# Altium project ZYNQ-HS-DEV.PrjPcb (part 1 of 4)
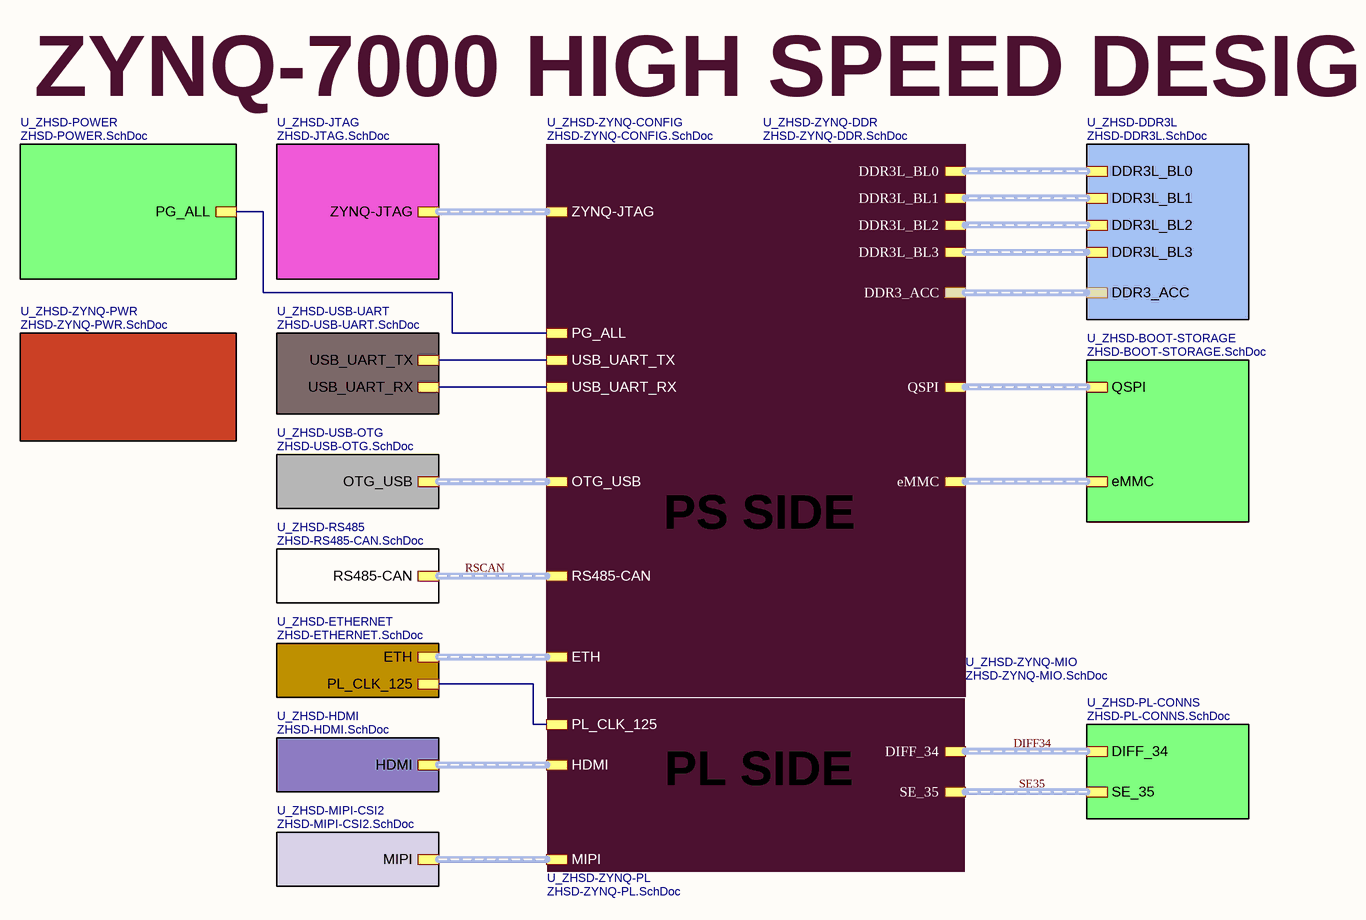
[diagram p0: ZHSD-Block.SchDoc]
17 sheets, 545 parts. Net scope: hierarchical (ports join the sheet entries above them; power ports are global).
Board file: ZYNQ-HS-DEV-PCB.PcbDoc
Sheets:
  ZHSD-Block.SchDoc
    U_ZHSD-ZYNQ-CONFIG = ZHSD-ZYNQ-CONFIG.SchDoc
    U_ZHSD-JTAG = ZHSD-JTAG.SchDoc
    U_ZHSD-ZYNQ-PWR = ZHSD-ZYNQ-PWR.SchDoc
    U_ZHSD-BOOT-STORAGE = ZHSD-BOOT-STORAGE.SchDoc
    U_ZHSD-ZYNQ-MIO = ZHSD-ZYNQ-MIO.SchDoc
    U_ZHSD-USB-OTG = ZHSD-USB-OTG.SchDoc
    U_ZHSD-ETHERNET = ZHSD-ETHERNET.SchDoc
    U_ZHSD-USB-UART = ZHSD-USB-UART.SchDoc
    U_ZHSD-RS485 = ZHSD-RS485-CAN.SchDoc
    U_ZHSD-ZYNQ-PL = ZHSD-ZYNQ-PL.SchDoc
    U_ZHSD-HDMI = ZHSD-HDMI.SchDoc
    U_ZHSD-MIPI-CSI2 = ZHSD-MIPI-CSI2.SchDoc
    U_ZHSD-ZYNQ-DDR = ZHSD-ZYNQ-DDR.SchDoc
    U_ZHSD-DDR3L = ZHSD-DDR3L.SchDoc
    U_ZHSD-POWER = ZHSD-POWER.SchDoc
    U_ZHSD-PL-CONNS = ZHSD-PL-CONNS.SchDoc

## Sheet ZHSD-Block.SchDoc
size 420 x 297 mm; DrawnBy: Muzaffer Nizam; DocumentNumber: 2; SheetNumber: 1; SheetTotal: 17; Size: A4

### Sub-sheets
U_ZHSD-BOOT-STORAGE = ZHSD-BOOT-STORAGE.SchDoc: QSPI (harness QSPI), eMMC (harness eMMC)
U_ZHSD-DDR3L = ZHSD-DDR3L.SchDoc: DDR3_ACC (harness DDR3_ACC), DDR3L_BL0 (harness DDR_H_BL0), DDR3L_BL1 (harness DDR_H_BL1), DDR3L_BL2 (harness DDR_H_BL2), DDR3L_BL3 (harness DDR_H_BL3)
U_ZHSD-ETHERNET = ZHSD-ETHERNET.SchDoc: ETH (harness ETH), PL_CLK_125
U_ZHSD-HDMI = ZHSD-HDMI.SchDoc: HDMI (harness HDMI)
U_ZHSD-JTAG = ZHSD-JTAG.SchDoc: ZYNQ-JTAG (harness JTAG)
U_ZHSD-MIPI-CSI2 = ZHSD-MIPI-CSI2.SchDoc: MIPI (harness MIPI)
U_ZHSD-PL-CONNS = ZHSD-PL-CONNS.SchDoc: DIFF_34 (harness PL34_DIFF), SE_35 (harness PL35_SE)
U_ZHSD-POWER = ZHSD-POWER.SchDoc: PG_ALL
U_ZHSD-RS485 = ZHSD-RS485-CAN.SchDoc: RS485-CAN (harness RS485-CAN)
U_ZHSD-USB-OTG = ZHSD-USB-OTG.SchDoc: OTG_USB (harness OTG)
U_ZHSD-USB-UART = ZHSD-USB-UART.SchDoc: USB_UART_TX, USB_UART_RX
U_ZHSD-ZYNQ-CONFIG = ZHSD-ZYNQ-CONFIG.SchDoc: ZYNQ-JTAG (harness JTAG)
U_ZHSD-ZYNQ-DDR = ZHSD-ZYNQ-DDR.SchDoc: DDR3L_BL0 (harness DDR_H_BL0), DDR3_ACC (harness DDR3_ACC), DDR3L_BL1 (harness DDR_H_BL1), DDR3L_BL2 (harness DDR_H_BL2), DDR3L_BL3 (harness DDR_H_BL3)
U_ZHSD-ZYNQ-MIO = ZHSD-ZYNQ-MIO.SchDoc: QSPI (harness QSPI), eMMC (harness eMMC), OTG_USB (harness OTG), ETH (harness ETH), USB_UART_TX, USB_UART_RX, RS485-CAN (harness RS485-CAN), PG_ALL
U_ZHSD-ZYNQ-PL = ZHSD-ZYNQ-PL.SchDoc: HDMI (harness HDMI), MIPI (harness MIPI), PL_CLK_125, DIFF_34 (harness PL34_DIFF), SE_35 (harness PL35_SE)
U_ZHSD-ZYNQ-PWR = ZHSD-ZYNQ-PWR.SchDoc: no entries

### Nets
3V3_PG: sheet U_ZHSD-ZYNQ-MIO/PG_ALL, sheet U_ZHSD-POWER/PG_ALL
PL_CLK_125: sheet U_ZHSD-ETHERNET/PL_CLK_125, sheet U_ZHSD-ZYNQ-PL/PL_CLK_125
USB_UART_RX: sheet U_ZHSD-ZYNQ-MIO/USB_UART_RX, sheet U_ZHSD-USB-UART/USB_UART_RX
USB_UART_TX: sheet U_ZHSD-ZYNQ-MIO/USB_UART_TX, sheet U_ZHSD-USB-UART/USB_UART_TX

### Buses and harness runs
harness DIFF34 = sheet U_ZHSD-PL-CONNS/DIFF_34 = sheet U_ZHSD-ZYNQ-PL/DIFF_34
harness RSCAN = sheet U_ZHSD-RS485/RS485-CAN = sheet U_ZHSD-ZYNQ-MIO/RS485-CAN
harness SE35 = sheet U_ZHSD-PL-CONNS/SE_35 = sheet U_ZHSD-ZYNQ-PL/SE_35
harness sheet U_ZHSD-BOOT-STORAGE/eMMC = sheet U_ZHSD-ZYNQ-MIO/eMMC
harness sheet U_ZHSD-BOOT-STORAGE/QSPI = sheet U_ZHSD-ZYNQ-MIO/QSPI
harness sheet U_ZHSD-DDR3L/DDR3_ACC = sheet U_ZHSD-ZYNQ-DDR/DDR3_ACC
harness sheet U_ZHSD-DDR3L/DDR3L_BL0 = sheet U_ZHSD-ZYNQ-DDR/DDR3L_BL0
harness sheet U_ZHSD-DDR3L/DDR3L_BL1 = sheet U_ZHSD-ZYNQ-DDR/DDR3L_BL1
harness sheet U_ZHSD-DDR3L/DDR3L_BL2 = sheet U_ZHSD-ZYNQ-DDR/DDR3L_BL2
harness sheet U_ZHSD-DDR3L/DDR3L_BL3 = sheet U_ZHSD-ZYNQ-DDR/DDR3L_BL3
harness sheet U_ZHSD-ETHERNET/ETH = sheet U_ZHSD-ZYNQ-MIO/ETH
harness sheet U_ZHSD-HDMI/HDMI = sheet U_ZHSD-ZYNQ-PL/HDMI
harness sheet U_ZHSD-JTAG/ZYNQ-JTAG = sheet U_ZHSD-ZYNQ-CONFIG/ZYNQ-JTAG
harness sheet U_ZHSD-MIPI-CSI2/MIPI = sheet U_ZHSD-ZYNQ-PL/MIPI
harness sheet U_ZHSD-USB-OTG/OTG_USB = sheet U_ZHSD-ZYNQ-MIO/OTG_USB

### Notes on the sheet
- ZYNQ-7000 HIGH SPEED DESIGN
- PS SIDE
- PL SIDE
- THIS DOCUMENT AND THE DATA DISCLOSED HEREIN OR
- HEREWITH IS THE PROPERTY OF ALTIUM LIMITED AND MAY
- DWG NO:
- REVISION
- REV:
- DESCRIPTION
- DATE
- APPROVED
- BE FREELY DISTRIBUTED IN WHOLE. NO RIGHTS ARE
- RESERVED OR EXPRESS OR IMPLIED WARANTEE GIVEN.
- ENG:
- APPROVALS
- PROJECT
- DSN:
- CHK:
- REFERENCE DOCUMENTS
- PROJECT REVISION:
- TITLE
- DOCUMENT REVISION:
- DESIGN ITEM:
- BOM:
- FAB DWG:
- PCB DWG:
- ASSY DWG:
- SCALE:
- A3
- SIZE
- CAGE CODE
- FILE NAME
- DWG NO.
- SHEET
- OF
- REV

## Sheet ZHSD-ZYNQ-CONFIG.SchDoc
size 420 x 297 mm; DocumentNumber: 4; SheetNumber: 4; SheetTotal: 17; Size: A4
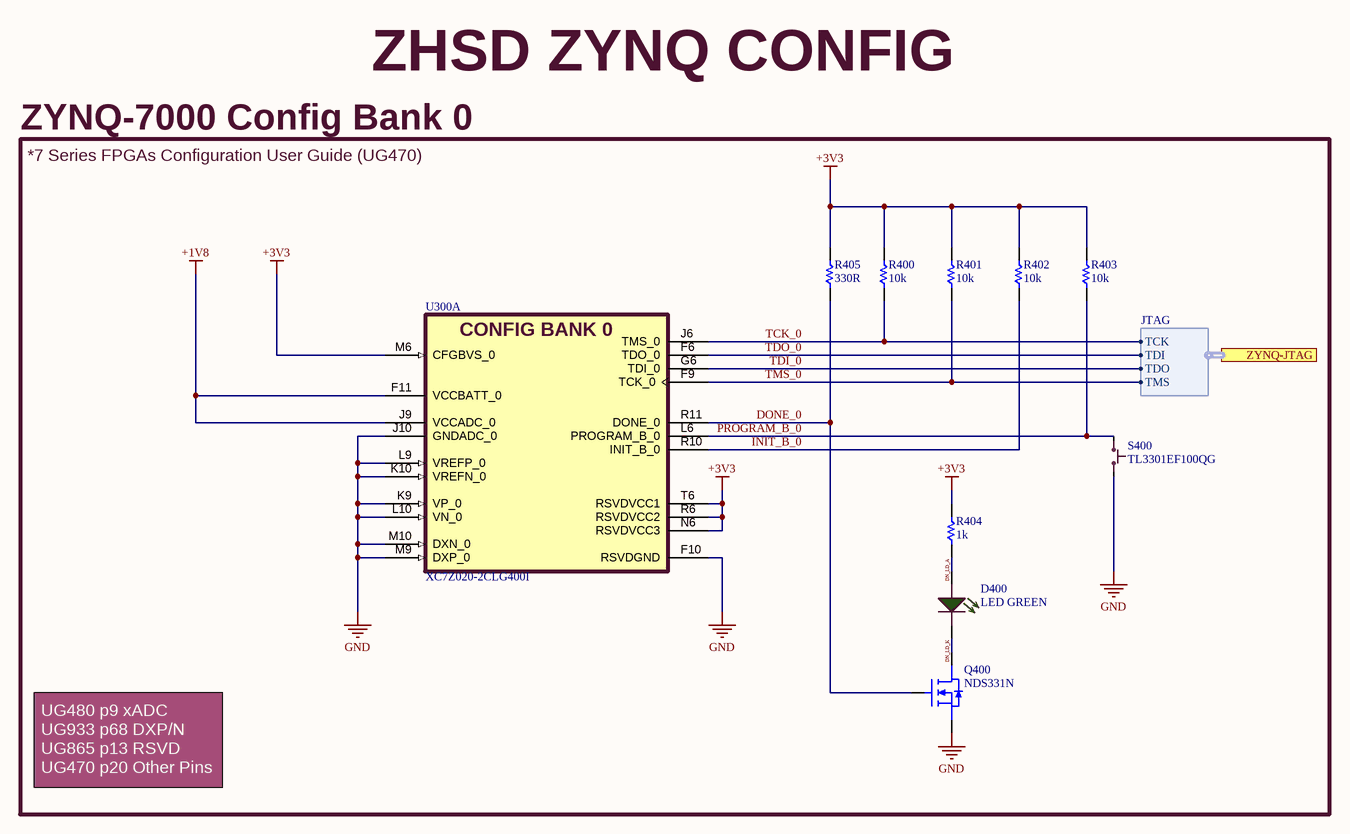
[diagram p1: ZHSD-ZYNQ-CONFIG.SchDoc]

### Parts
D400  LED GREEN  [0603_LED_1608N]
Q400  NDS331N  [SOT95P251X112-3N]
R400  10k  [0603RESC1608X05N]
R401  10k  [0603RESC1608X05N]
R402  10k  [0603RESC1608X05N]
R403  10k  [0603RESC1608X05N]
R404  1k  [0402RESC1005X04N]
R405  330R  [0603RESC1608X05N]
S400  TL3301EF100QG  [TL3301_Tact_SW]
U300  XC7Z020-2CLG400I  [BGA400C80P20X20_1700X1700X147]  (part A of 8)

### Ports
ZYNQ-JTAG (harness JTAG, see ZHSD-Block[174.76,200.78], ZHSD-JTAG[297.22,176.76])

### Harnesses
JTAG: TCK, TDI, TDO, TMS

### Nets
+1V8: U300.F11(VCCBATT_0) U300.J9(VCCADC_0)
+3V3: R400.2 R401.2 R402.2 R403.2 R404.2 R405.2 U300.M6(CFGBVS_0) U300.N6(RSVDVCC3) U300.R6(RSVDVCC2) U300.T6(RSVDVCC1)
GND: Q400.2(S) S400.1,2 U300.F10(RSVDGND) U300.J10(GNDADC_0) U300.K9(VP_0) U300.K10(VREFN_0) U300.L9(VREFP_0) U300.L10(VN_0) U300.M9(DXP_0) U300.M10(DXN_0)
DN_LD_A: D400.1(A) R404.1
DN_LD_K: D400.2(C) Q400.3(D)
DONE_0: Q400.1(G) R405.1 U300.R11(DONE_0)
INIT_B_0: R402.1 U300.R10(INIT_B_0)
PROGRAM_B_0: R403.1 S400.3,4 U300.L6(PROGRAM_B_0)
TCK_0: R400.1 U300.J6(TMS_0) ; port ZYNQ-JTAG.TCK
TDI_0: U300.G6(TDI_0) ; port ZYNQ-JTAG.TDO
TDO_0: U300.F6(TDO_0) ; port ZYNQ-JTAG.TDI
TMS_0: R401.1 U300.F9(TCK_0) ; port ZYNQ-JTAG.TMS

### Notes on the sheet
- ZHSD ZYNQ CONFIG
- ZYNQ-7000 Config Bank 0
- *7 Series FPGAs Configuration User Guide (UG470)
- UG480 p9 xADC
  UG933 p68 DXP/N
  UG865 p13 RSVD
  UG470 p20 Other Pins
- THIS DOCUMENT AND THE DATA DISCLOSED HEREIN OR
- HEREWITH IS THE PROPERTY OF ALTIUM LIMITED AND MAY
- DWG NO:
- REVISION
- REV:
- DESCRIPTION
- DATE
- APPROVED
- BE FREELY DISTRIBUTED IN WHOLE. NO RIGHTS ARE
- RESERVED OR EXPRESS OR IMPLIED WARANTEE GIVEN.
- ENG:
- APPROVALS
- PROJECT
- DSN:
- CHK:
- REFERENCE DOCUMENTS
- PROJECT REVISION:
- TITLE
- DOCUMENT REVISION:
- DESIGN ITEM:
- BOM:
- FAB DWG:
- PCB DWG:
- ASSY DWG:
- SCALE:
- A3
- SIZE
- CAGE CODE
- FILE NAME
- DWG NO.
- SHEET
- OF
- REV
- (in symbol XC7Z020-2CLG400I, part A) CONFIG BANK 0

### Library data of the parts
D400 = LTST-C191TGKT: LED GREEN CLEAR CHIP SMD; Manufacturer: Lite-On Inc.; ComponentLink1Description: Datasheet; ComponentLink1URL: https://optoelectronics.liteon.com/upload/download/DS22-2000-300/LTST-C191TGKT.PDF; MPN: LTST-C191TGKT; Package: 0603
Q400 = NDS331N: N-Channel 20 V 1.3A (Ta) 500mW (Ta) Surface Mount SOT-23-3; Manufacturer: onsemi; Drain to Source Voltage (Vdss): 20 V; Rds On (Max) @ Id, Vgs: 160mOhm @ 1.5A, 4.5V; Vgs (Max): ±8V; ComponentLink1Description: Datasheet; ComponentLink1URL: https://www.onsemi.com/pdf/datasheet/nds331n-d.pdf; MPN: NDS331N; Package: SOT-23-3
R400-R403 = RC0603FR-0710KL: RES 10K OHM 1% 1/10W 0603(1608); Manufacturer: YAGEO; Value: 10 kOhms; Voltage: 75V; ComponentLink1Description: Datasheet; ComponentLink1URL: https://yageogroup.com/content/datasheet/asset/file/PYU-RC_GROUP_51_ROHS_L; MPN: RC0603FR-0710KL; Tolerance: ±1%; Package: 0603
R404 = RC0402JR-071KL: RES 1K OHM 5% 1/16W 0402 (1005); Manufacturer: YAGEO; Value: 1 kOhms; Voltage: 50V; ComponentLink1Description: Datasheet; ComponentLink1URL: https://yageogroup.com/content/datasheet/asset/file/PYU-RT_1-TO-0-01_ROHS_L; MPN: RC0402JR-071KL; Tolerance: ±5%; Package: 0402
R405 = RC0603FR-07330RL: RES 330 OHM 1% 1/10W 0603(1608); Manufacturer: YAGEO; Value: 330 Ohms; Voltage: 75V; ComponentLink1Description: Datasheet; ComponentLink1URL: https://yageogroup.com/content/datasheet/asset/file/PYU-RC_GROUP_51_ROHS_L; MPN: RC0603FR-07330RL; Tolerance: ±1%; Package: 0603
S400 = TL3301EF100QG: SWITCH TACTILE SPST-NO 0.05A 12V; pin to pad: 1,2>1+2 3,4>3+4; Manufacturer: E-Switch; ComponentLink1Description: Datasheet; ComponentLink1URL: https://configured-product-images.s3.amazonaws.com/Datasheets/TL3301.pdf; MPN: TL3301EF100QG
U300 = XC7Z020-2CLG400I: Dual ARM® Cortex®-A9 MPCore™ with CoreSight™ System On Chip (SOC) IC Zynq®-7000 Artix™-7 FPGA, 85K Logic Cells 766MHz 400-CSPBGA (17x17); Manufacturer: AMD/XILINX; MPN: XC7Z020-2CLG400I; ComponentLink1Description: Datasheet; ComponentLink1URL: https://docs.amd.com/v/u/en-US/ds190-Zynq-7000-Overview; ComponentLink2Description: DC and AC Switching Characteristics; ComponentLink2URL: https://docs.amd.com/v/u/en-US/ds187-XC7Z010-XC7Z020-Data-Sheet; ComponentLink3Description: PCB Design Guide; ComponentLink3URL: https://docs.amd.com/v/u/en-US/ug933-Zynq-7000-PCB; ComponentLink4Description: Packaging and Pinout; ComponentLink4URL: https://docs.amd.com/v/u/en-US/ug865-Zynq-7000-Pkg-Pinout; ComponentLink5Description: Zynq 7000 SoC Technical Reference Manual; ComponentLink5URL: https://docs.amd.com/r/en-US/ug585-zynq-7000-SoC-TRM

## Sheet ZHSD-JTAG.SchDoc
size 420 x 297 mm; DocumentNumber: 5; SheetNumber: 5; SheetTotal: 17; Size: A4
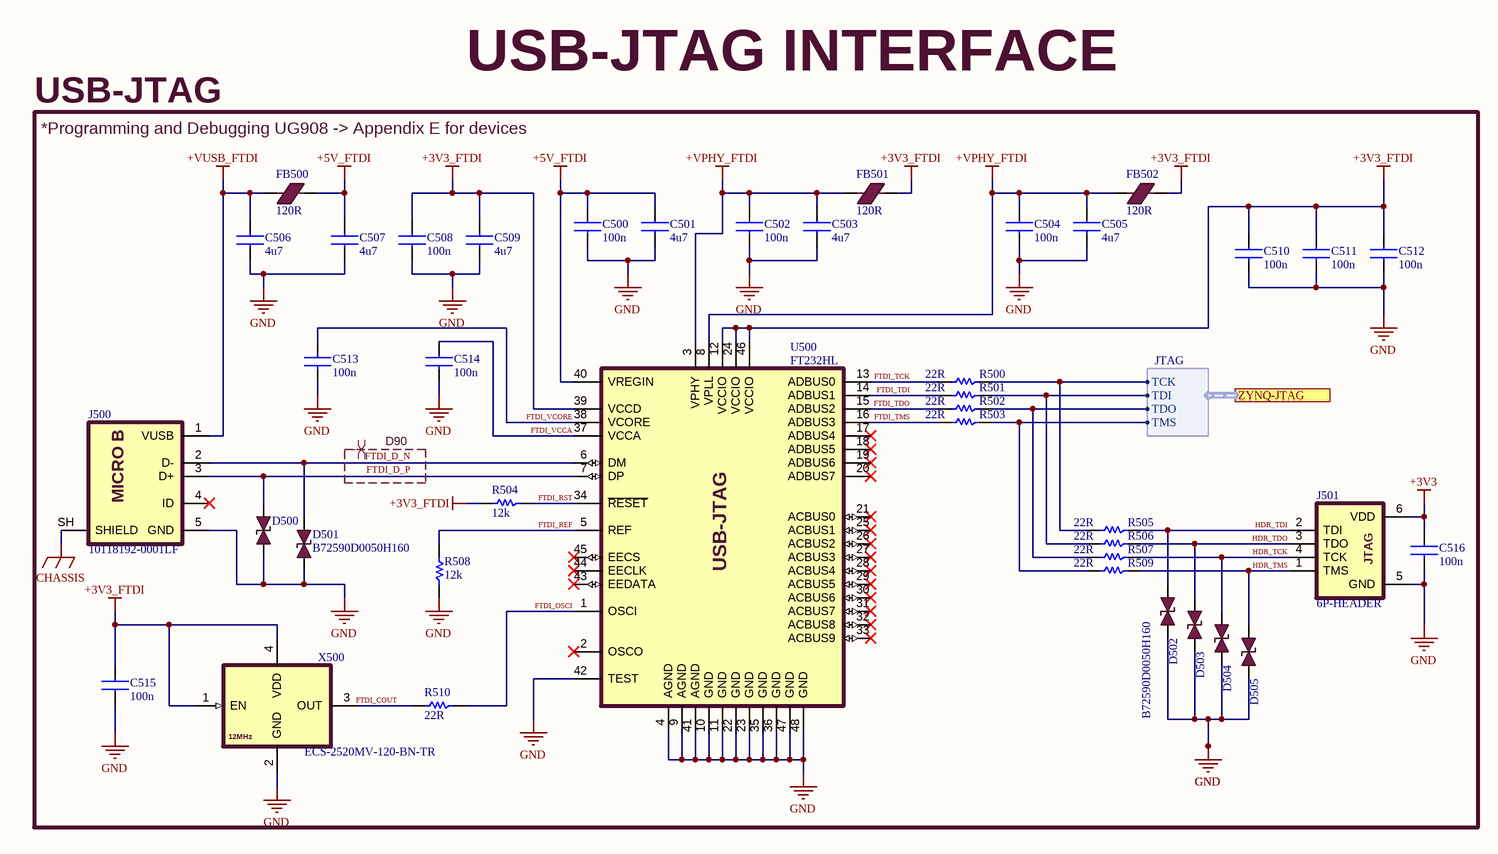
[diagram p2: ZHSD-JTAG.SchDoc]

### Parts
C500  100n  [0603CAPC1608X09N]
C501  4u7  [0603CAPC1608X09N]
C502  100n  [0603CAPC1608X09N]
C503  4u7  [0603CAPC1608X09N]
C504  100n  [0603CAPC1608X09N]
C505  4u7  [0603CAPC1608X09N]
C506  4u7  [0603CAPC1608X09N]
C507  4u7  [0603CAPC1608X09N]
C508  100n  [0603CAPC1608X09N]
C509  4u7  [0603CAPC1608X09N]
C510  100n  [0603CAPC1608X09N]
C511  100n  [0603CAPC1608X09N]
C512  100n  [0603CAPC1608X09N]
C513  100n  [0603CAPC1608X09N]
C514  100n  [0603CAPC1608X09N]
C515  100n  [0603CAPC1608X09N]
C516  100n  [0603CAPC1608X09N]
D500  B72590D0050H160  [0402DIOC1005X06N]  (value not drawn)
D501  B72590D0050H160  [0402DIOC1005X06N]
D502  B72590D0050H160  [0402DIOC1005X06N]  (value not drawn)
D503  B72590D0050H160  [0402DIOC1005X06N]  (value not drawn)
D504  B72590D0050H160  [0402DIOC1005X06N]  (value not drawn)
D505  B72590D0050H160  [0402DIOC1005X06N]
FB500  120R  [0603INDC1608X08N]
FB501  120R  [0603INDC1608X08N]
FB502  120R  [0603INDC1608X08N]
J500  10118192-0001LF  [USB2.0 MICRO B SMD]
J501  6P-HEADER  [CONN-6P-HEADER]
R500  22R  [0603RESC1608X05N]
R501  22R  [0603RESC1608X05N]
R502  22R  [0603RESC1608X05N]
R503  22R  [0603RESC1608X05N]
R504  12k  [0603RESC1608X05N]
R505  22R  [0603RESC1608X05N]
R506  22R  [0603RESC1608X05N]
R507  22R  [0603RESC1608X05N]
R508  12k  [0603RESC1608X05N]
R509  22R  [0603RESC1608X05N]
R510  22R  [0603RESC1608X05N]
U500  FT232HL  [LQFP50P900X900X160-48N]
X500  ECS-2520MV-120-BN-TR  [XTAL_2520]

### Ports
ZYNQ-JTAG (harness JTAG, see ZHSD-Block[154.44,200.78], ZHSD-ZYNQ-CONFIG[302.46,177.38])

### Harnesses
JTAG: TCK, TDI, TDO, TMS

### Nets
+3V3: C516.2 J501.6(VDD)
+3V3_FTDI: C508.2 C509.2 C510.2 C511.2 C512.2 C515.2 FB501.2 FB502.2 R504.1 U500.12(VCCIO) U500.24(VCCIO) U500.39(VCCD) U500.46(VCCIO) X500.1(EN) X500.4(VDD)
+5V_FTDI: C500.2 C501.2 C507.2 FB500.2 U500.40(VREGIN)
+VPHY_FTDI: C502.2 C503.2 C504.2 C505.2 FB501.1 FB502.1 U500.3(VPHY) U500.8(VPLL)
+VUSB_FTDI: C506.2 FB500.1 J500.1(VUSB)
CHASSIS: J500.SH(SHIELD)
GND: C500.1 C501.1 C502.1 C503.1 C504.1 C505.1 C506.1 C507.1 C508.1 C509.1 C510.1 C511.1 C512.1 C513.1 C514.1 C515.1 C516.1 D500.1 D501.1 D502.1 D503.1 D504.1 D505.1 J500.5(GND) J501.5(GND) R508.2 U500.4(AGND) U500.9(AGND) U500.10(GND) U500.11(GND) U500.22(GND) U500.23(GND) U500.35(GND) U500.36(GND) U500.41(AGND) U500.42(TEST) U500.47(GND) U500.48(GND) X500.2(GND)
FTDI_COUT: R510.1 X500.3(OUT)
FTDI_D_N: D501.2 J500.2(D-) U500.6(DM)
FTDI_D_P: D500.2 J500.3(D+) U500.7(DP)
FTDI_OSCI: R510.2 U500.1(OSCI)
FTDI_REF: R508.1 U500.5(REF)
FTDI_RST: R504.2 U500.34(~{RESET})
FTDI_TCK: R500.1 U500.13(ADBUS0)
FTDI_TDI: R501.1 U500.14(ADBUS1)
FTDI_TDO: R502.1 U500.15(ADBUS2)
FTDI_TMS: R503.1 U500.16(ADBUS3)
FTDI_VCCA: C514.2 U500.37(VCCA)
FTDI_VCORE: C513.2 U500.38(VCORE)
HDR_TCK: D504.2 J501.4(TCK) R507.2
HDR_TDI: D502.2 J501.2(TDI) R505.2
HDR_TDO: D503.2 J501.3(TDO) R506.2
HDR_TMS: D505.2 J501.1(TMS) R509.2
TCK_0: R500.2 R505.1 ; port ZYNQ-JTAG.TCK
TDI_0: R502.2 R507.1 ; port ZYNQ-JTAG.TDO
TDO_0: R501.2 R506.1 ; port ZYNQ-JTAG.TDI
TMS_0: R503.2 R509.1 ; port ZYNQ-JTAG.TMS

Not connected (* = marked no-connect by the designer): J500 4(ID)*; U500 2(OSCO)* 17(ADBUS4)* 18(ADBUS5)* 19(ADBUS6)* 20(ADBUS7)* 21(ACBUS0)* 25(ACBUS1)* 26(ACBUS2)* 27(ACBUS3)* 28(ACBUS4)* 29(ACBUS5)* 30(ACBUS6)* 31(ACBUS7)* 32(ACBUS8)* 33(ACBUS9)* 43(EEDATA)* 44(EECLK)* 45(EECS)*

### Layout directives
differential pair; differential pair class USB; rule Differential Pairs Routing [Pref Gap = 6.299mil    Min Gap  = 5mil    Max Gap  = 7.874milPref Width = 3.937mil    Min Width  = 3.937mil    Max Width  = 4.768mil]; Impedance: D90: FTDI_D_N, FTDI_D_P

### Notes on the sheet
- USB-JTAG INTERFACE
- USB-JTAG
- *Programming and Debugging UG908 -> Appendix E for devices
- THIS DOCUMENT AND THE DATA DISCLOSED HEREIN OR
- HEREWITH IS THE PROPERTY OF ALTIUM LIMITED AND MAY
- DWG NO:
- REVISION
- REV:
- DESCRIPTION
- DATE
- APPROVED
- BE FREELY DISTRIBUTED IN WHOLE. NO RIGHTS ARE
- RESERVED OR EXPRESS OR IMPLIED WARANTEE GIVEN.
- ENG:
- APPROVALS
- PROJECT
- DSN:
- CHK:
- REFERENCE DOCUMENTS
- PROJECT REVISION:
- TITLE
- DOCUMENT REVISION:
- DESIGN ITEM:
- BOM:
- FAB DWG:
- PCB DWG:
- ASSY DWG:
- SCALE:
- A3
- SIZE
- CAGE CODE
- FILE NAME
- DWG NO.
- SHEET
- OF
- REV
- (in symbol ECS-2520MV-120-BN-TR) 12MHz
- (in symbol FT232HL) USB-JTAG
- (in symbol JTAG-HEADER) JTAG
- (in symbol USB-MICRO-B) MICRO B

### Library data of the parts
C500 C502 C504 C508 C510-C516 = GRM155R71C104KA88J: CAP CER 0.1UF 16V X7R 0402 (1005) ±10%; Manufacturer: Murata Electronics; Value: 0.1 µF; ComponentLink1Description: Datasheet; ComponentLink1URL: https://search.murata.co.jp/Ceramy/image/img/A01X/G101/ENG/GRM155R71C104KA88-01.pdf; MPN: GRM155R71C104KA88J; Package: 0402; Tolerance: ±10%; Voltage: 16V
C501 C503 C505-C507 C509 = CL10A475KP8NNNC: CAP CER 4.7UF 10V X5R 0603 (1608) ±10%; Manufacturer: Samsung Electro-Mechanics; Value: 4.7 µF; ComponentLink1Description: Datasheet; ComponentLink1URL: https://mm.digikey.com/Volume0/opasdata/d220001/medias/docus/609/CL10A475KP8NNNC_Spec.pdf; MPN: CL10A475KP8NNNC; Package: 0603; Tolerance: ±10%; Voltage: 10V
D500-D505 = B72590D0050H160: Varistor 1 Circuit Surface Mount, MLCV 0402 (1005 Metric); Manufacturer: EPCOS - TDK Electronics; ComponentLink1Description: Datasheet; ComponentLink1URL: https://www.tdk-electronics.tdk.com/inf/75/ds/High_speed_series.pdf?ref_disty=digikey; MPN: B72590D0050H160; Package: 0402
FB500-FB502 = BLM18SG121TN1D: FERRITE BEAD 120 OHM 0603 (1608) 3A 25mOhm; Manufacturer: Murata Electronics; Impedance @ Frequency: 120 Ohms @ 100 MHz; ComponentLink1Description: Datasheet; ComponentLink1URL: https://pim.murata.com/asset/pim4/ferriteBeadInductortypefilter/ENFA0003_PDF_FERRITEBEADINDUCTORTYPEFILTER?lastModifiedDatetime=20250707190934; ComponentLink2Description: Website; ComponentLink2URL: https://pim.murata.com/en-global/pim/details/?partNum=BLM18SG121TN1%23; Current Rating (Max): 3A; DC Resistance (DCR) (Max): 25mOhm; MPN: BLM18SG121TN1D; Package: 0603
J500 = USB-MICRO-B: CONN RCPT USB2.0 MICRO B SMD R/A; Manufacturer: Amphenol ICC (FCI); ComponentLink1Description: Datasheet; ComponentLink1URL: https://cdn.amphenol-cs.com/media/wysiwyg/files/documentation/datasheet/inputoutput/io_usb_micro.pdf; MPN: 10118192-0001LF
J501 = JTAG-HEADER: JTAG CONN HEADER VERT 6POS 2.54MM
R500-R503 R505-R507 R509 R510 = RC0603FR-0722RL: RES 22 OHM 1% 1/10W 0603 (1608); Manufacturer: YAGEO; Value: 22 Ohms; Voltage: 75V; ComponentLink1Description: Datasheet; ComponentLink1URL: https://yageogroup.com/content/datasheet/asset/file/PYU-RC_GROUP_51_ROHS_L; MPN: RC0603FR-0722RL; Tolerance: ±1%; Package: 0603
R504 R508 = RC0603FR-0712KL: RES 12K OHM 1% 1/10W 0603 (1608); Manufacturer: YAGEO; Value: 12 kOhms; Voltage: 75V; ComponentLink1Description: Datasheet; ComponentLink1URL: https://yageogroup.com/content/datasheet/asset/file/PYU-RC_GROUP_51_ROHS_L; MPN: RC0603FR-0712KL; Tolerance: ±1%; Package: 0603
U500 = FT232HL: USB Bridge, USB to UART (JTAG),FIFO USB 2.0 UART, FIFO Interface 48-LQFP (7x7); Manufacturer: FTDI, Future Technology Devices International Ltd; MPN: FT232HL-REEL; ComponentLink1Description: Datasheet; ComponentLink1URL: https://ftdichip.com/wp-content/uploads/2024/09/DS_FT232H.pdf#page=51&zoom=100,72,126
X500 = ECS-2520MV-120-BN-TR: XTAL OSC XO 12.0000MHZ CMOS SMD; Manufacturer: ECS Inc.; ComponentLink1Description: Datasheet; ComponentLink1URL: https://ecsxtal.com/store/pdf/ECS-2520MV.pdf; MPN: ECS-2520MV-120-BN-TR

## Sheet ZHSD-ZYNQ-PWR.SchDoc
size 420 x 297 mm; DocumentNumber: 3; SheetNumber: 3; SheetTotal: 17; Size: A3
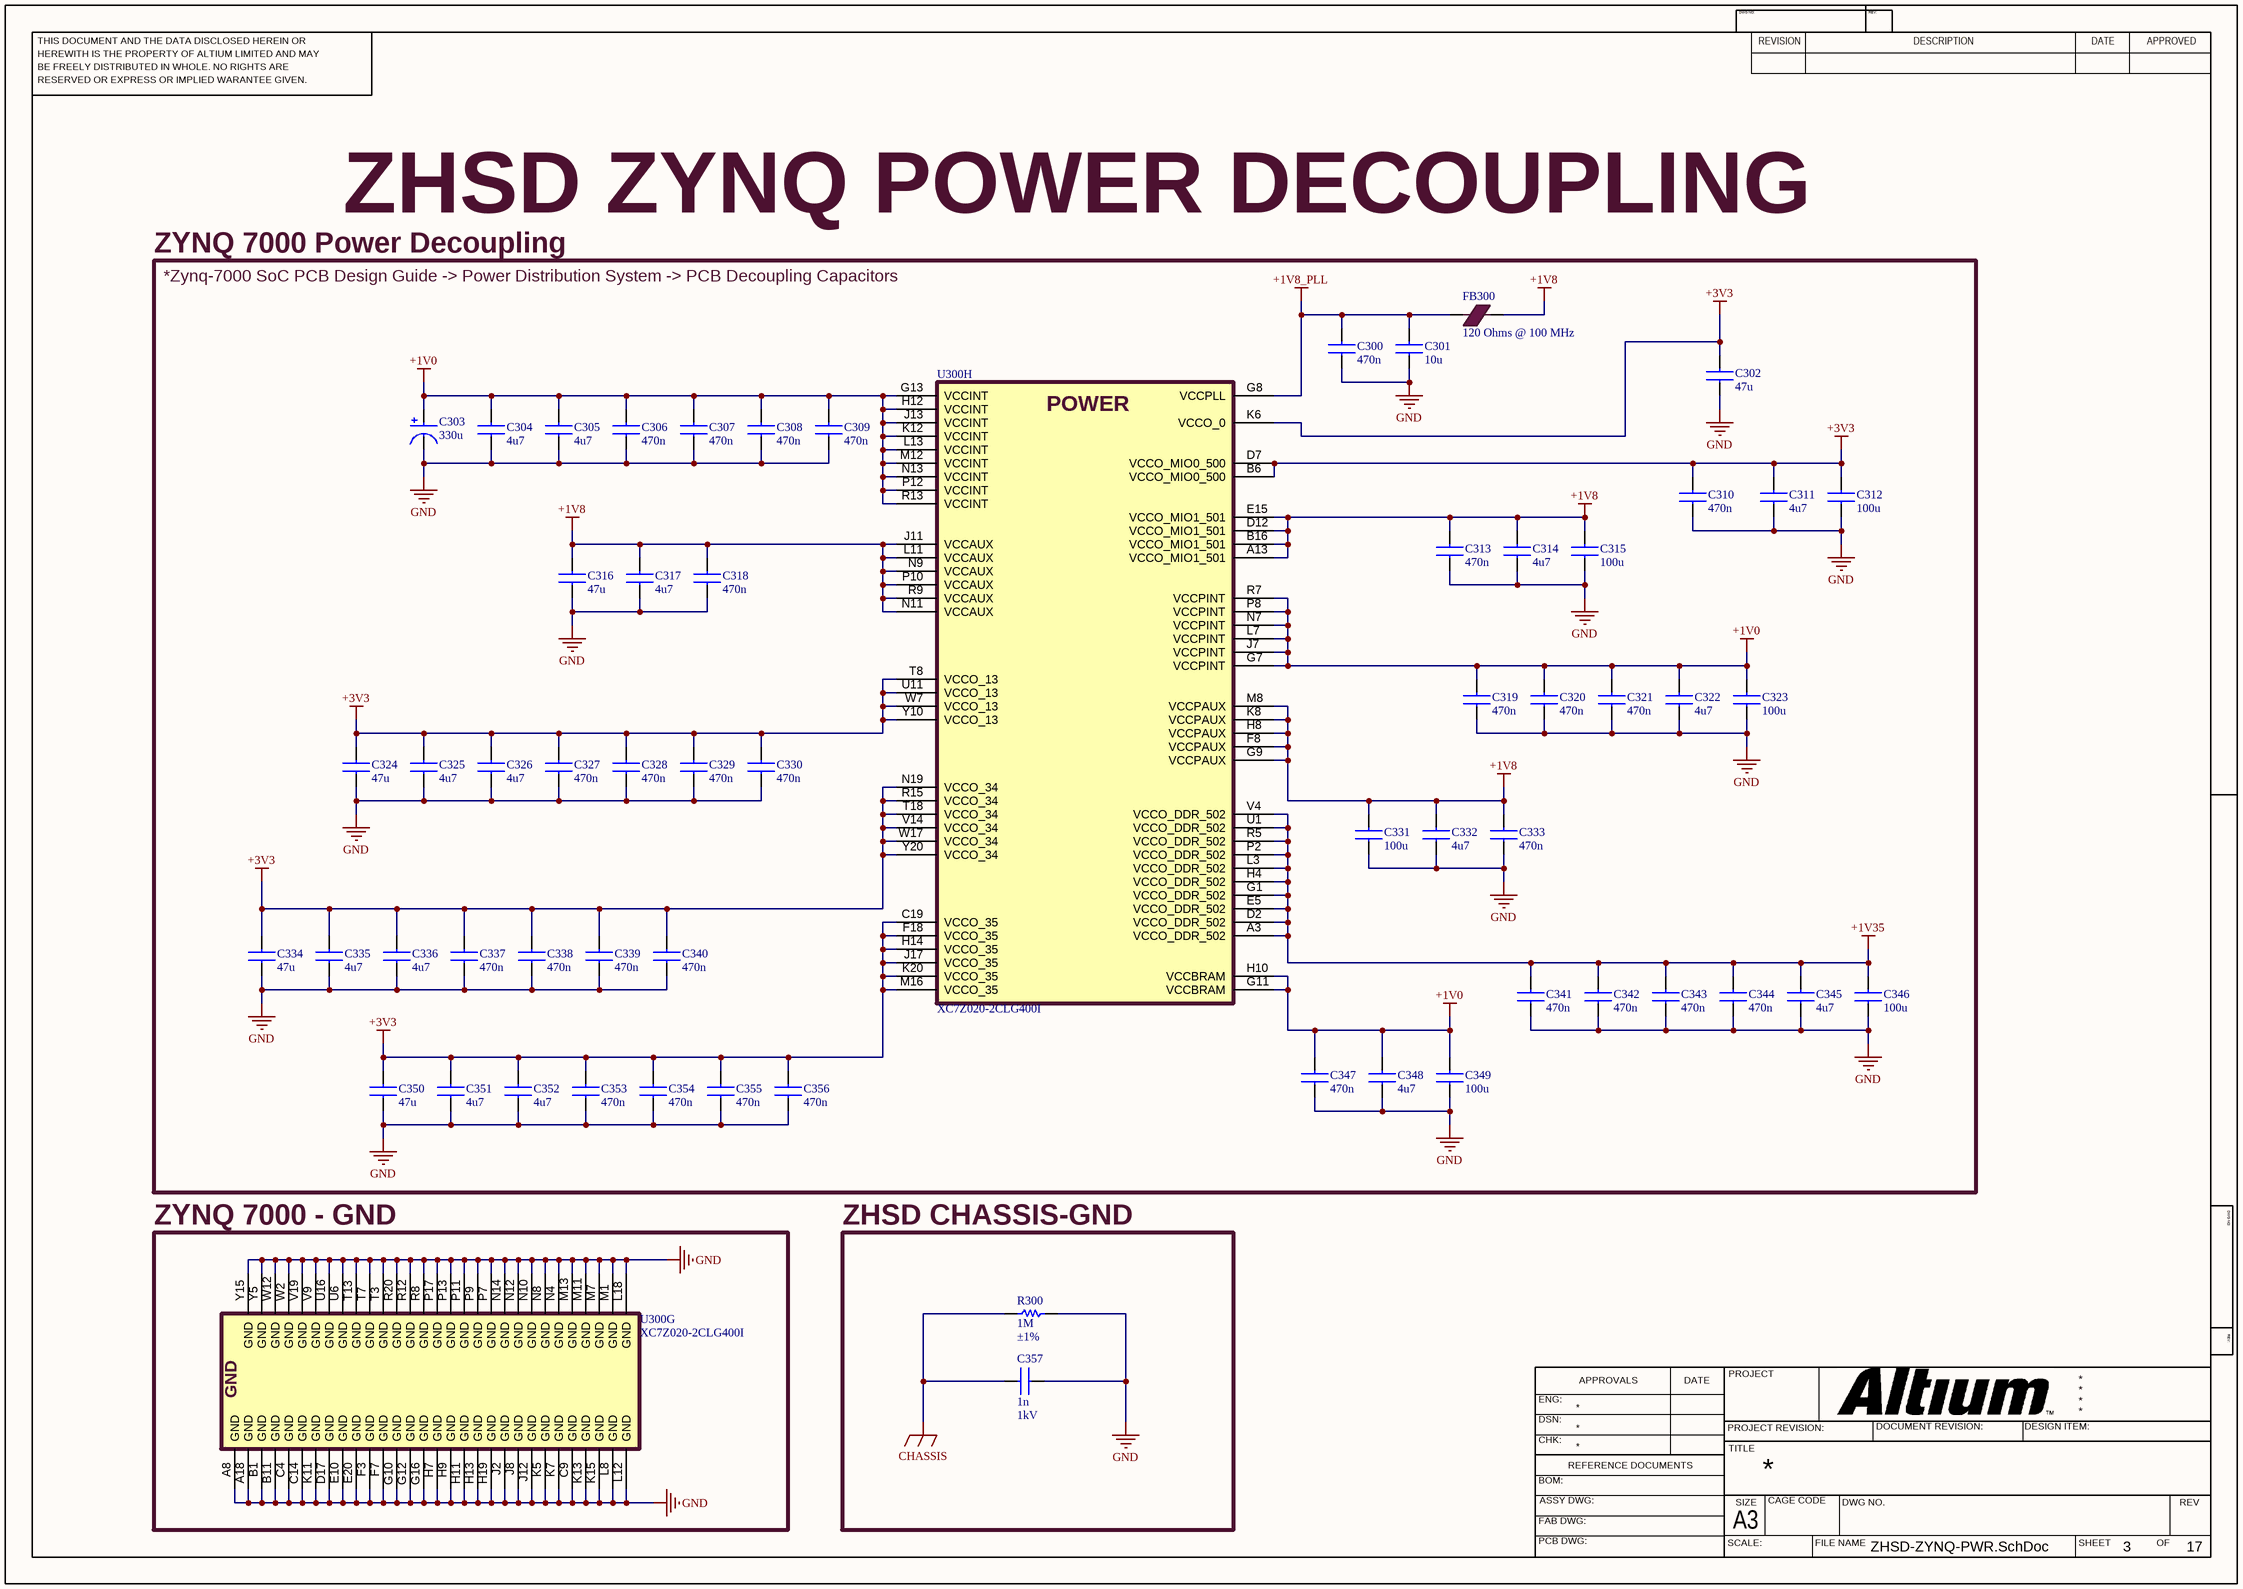
[diagram p3: ZHSD-ZYNQ-PWR.SchDoc]

### Parts
C300  470n  [0402CAPC1005X06N]
C301  10u  [0603CAPC1608X09N]
C302  47u  [1210CAPC3225X27N]
C303  330u  [T525D337M006ATE025]
C304  4u7  [0603CAPC1608X09N]
C305  4u7  [0603CAPC1608X09N]
C306  470n  [0402CAPC1005X06N]
C307  470n  [0402CAPC1005X06N]
C308  470n  [0402CAPC1005X06N]
C309  470n  [0402CAPC1005X06N]
C310  470n  [0402CAPC1005X06N]
C311  4u7  [0603CAPC1608X09N]
C312  100u  [1210CAPC3225X27N]
C313  470n  [0402CAPC1005X06N]
C314  4u7  [0603CAPC1608X09N]
C315  100u  [1210CAPC3225X27N]
C316  47u  [1210CAPC3225X27N]
C317  4u7  [0603CAPC1608X09N]
C318  470n  [0402CAPC1005X06N]
C319  470n  [0402CAPC1005X06N]
C320  470n  [0402CAPC1005X06N]
C321  470n  [0402CAPC1005X06N]
C322  4u7  [0603CAPC1608X09N]
C323  100u  [1210CAPC3225X27N]
C324  47u  [1210CAPC3225X27N]
C325  4u7  [0603CAPC1608X09N]
C326  4u7  [0603CAPC1608X09N]
C327  470n  [0402CAPC1005X06N]
C328  470n  [0402CAPC1005X06N]
C329  470n  [0402CAPC1005X06N]
C330  470n  [0402CAPC1005X06N]
C331  100u  [1210CAPC3225X27N]
C332  4u7  [0603CAPC1608X09N]
C333  470n  [0402CAPC1005X06N]
C334  47u  [1210CAPC3225X27N]
C335  4u7  [0603CAPC1608X09N]
C336  4u7  [0603CAPC1608X09N]
C337  470n  [0402CAPC1005X06N]
C338  470n  [0402CAPC1005X06N]
C339  470n  [0402CAPC1005X06N]
C340  470n  [0402CAPC1005X06N]
C341  470n  [0402CAPC1005X06N]
C342  470n  [0402CAPC1005X06N]
C343  470n  [0402CAPC1005X06N]
C344  470n  [0402CAPC1005X06N]
C345  4u7  [0603CAPC1608X09N]
C346  100u  [1210CAPC3225X27N]
C347  470n  [0402CAPC1005X06N]
C348  4u7  [0603CAPC1608X09N]
C349  100u  [1210CAPC3225X27N]
C350  47u  [1210CAPC3225X27N]
C351  4u7  [0603CAPC1608X09N]
C352  4u7  [0603CAPC1608X09N]
C353  470n  [0402CAPC1005X06N]
C354  470n  [0402CAPC1005X06N]
C355  470n  [0402CAPC1005X06N]
C356  470n  [0402CAPC1005X06N]
C357  1n  Voltage: 1kV  [0805CAPC2012X14N]
FB300  120 Ohms @ 100 MHz  [0603INDC1608X08N]
R300  1M  Tolerance: ±1%  [0603RESC1608X05N]
U300  XC7Z020-2CLG400I  [BGA400C80P20X20_1700X1700X147]  (parts G,H of 8)

### Blocks framed on the sheet
ZYNQ 7000 Power Decoupling: C300-C356 FB300 U300
ZYNQ 7000 - GND: U300
ZHSD CHASSIS-GND: C357 R300

### Nets
+1V0: C303.1 C304.2 C305.2 C306.2 C307.2 C308.2 C309.2 C319.2 C320.2 C321.2 C322.2 C323.1 C347.2 C348.2 C349.1 U300.G7(VCCPINT) U300.G11(VCCBRAM) U300.G13(VCCINT) U300.H10(VCCBRAM) U300.H12(VCCINT) U300.J7(VCCPINT) U300.J13(VCCINT) U300.K12(VCCINT) U300.L7(VCCPINT) U300.L13(VCCINT) U300.M12(VCCINT) U300.N7(VCCPINT) U300.N13(VCCINT) U300.P8(VCCPINT) U300.P12(VCCINT) U300.R7(VCCPINT) U300.R13(VCCINT)
+1V8: C313.2 C314.2 C315.1 C316.2 C317.2 C318.2 C331.1 C332.2 C333.2 FB300.2 U300.A13(VCCO_MIO1_501) U300.B16(VCCO_MIO1_501) U300.D12(VCCO_MIO1_501) U300.E15(VCCO_MIO1_501) U300.F8(VCCPAUX) U300.G9(VCCPAUX) U300.H8(VCCPAUX) U300.J11(VCCAUX) U300.K8(VCCPAUX) U300.L11(VCCAUX) U300.M8(VCCPAUX) U300.N9(VCCAUX) U300.N11(VCCAUX) U300.P10(VCCAUX) U300.R9(VCCAUX)
+1V8_PLL: C300.2 C301.2 FB300.1 U300.G8(VCCPLL)
+1V35: C341.2 C342.2 C343.2 C344.2 C345.2 C346.1 U300.A3(VCCO_DDR_502) U300.D2(VCCO_DDR_502) U300.E5(VCCO_DDR_502) U300.G1(VCCO_DDR_502) U300.H4(VCCO_DDR_502) U300.L3(VCCO_DDR_502) U300.P2(VCCO_DDR_502) U300.R5(VCCO_DDR_502) U300.U1(VCCO_DDR_502) U300.V4(VCCO_DDR_502)
+3V3: C302.2 C310.2 C311.2 C312.1 C324.2 C325.2 C326.2 C327.2 C328.2 C329.2 C330.2 C334.2 C335.2 C336.2 C337.2 C338.2 C339.2 C340.2 C350.2 C351.2 C352.2 C353.2 C354.2 C355.2 C356.2 U300.B6(VCCO_MIO0_500) U300.C19(VCCO_35) U300.D7(VCCO_MIO0_500) U300.F18(VCCO_35) U300.H14(VCCO_35) U300.J17(VCCO_35) U300.K6(VCCO_0) U300.K20(VCCO_35) U300.M16(VCCO_35) U300.N19(VCCO_34) U300.R15(VCCO_34) U300.T8(VCCO_13) U300.T18(VCCO_34) U300.U11(VCCO_13) U300.V14(VCCO_34) U300.W7(VCCO_13) U300.W17(VCCO_34) U300.Y10(VCCO_13) U300.Y20(VCCO_34)
CHASSIS: C357.2 R300.1
GND: C300.1 C301.1 C302.1 C303.2 C304.1 C305.1 C306.1 C307.1 C308.1 C309.1 C310.1 C311.1 C312.2 C313.1 C314.1 C315.2 C316.1 C317.1 C318.1 C319.1 C320.1 C321.1 C322.1 C323.2 C324.1 C325.1 C326.1 C327.1 C328.1 C329.1 C330.1 C331.2 C332.1 C333.1 C334.1 C335.1 C336.1 C337.1 C338.1 C339.1 C340.1 C341.1 C342.1 C343.1 C344.1 C345.1 C346.2 C347.1 C348.1 C349.2 C350.1 C351.1 C352.1 C353.1 C354.1 C355.1 C356.1 C357.1 R300.2 U300.A8(GND) U300.A18(GND) U300.B1(GND) U300.B11(GND) U300.C4(GND) U300.C9(GND) U300.C14(GND) U300.D17(GND) U300.E10(GND) U300.E20(GND) U300.F3(GND) U300.F7(GND) U300.G10(GND) U300.G12(GND) U300.G16(GND) U300.H7(GND) U300.H9(GND) U300.H11(GND) U300.H13(GND) U300.H19(GND) U300.J2(GND) U300.J8(GND) U300.J12(GND) U300.K5(GND) U300.K7(GND) U300.K11(GND) U300.K13(GND) U300.K15(GND) U300.L8(GND) U300.L12(GND) U300.L18(GND) U300.M1(GND) U300.M7(GND) U300.M11(GND) U300.M13(GND) U300.N4(GND) U300.N8(GND) U300.N10(GND) U300.N12(GND) U300.N14(GND) U300.P7(GND) U300.P9(GND) U300.P11(GND) U300.P13(GND) U300.P17(GND) U300.R8(GND) U300.R12(GND) U300.R20(GND) U300.T3(GND) U300.T7(GND) U300.T13(GND) U300.U6(GND) U300.U16(GND) U300.V9(GND) U300.V19(GND) U300.W2(GND) U300.W12(GND) U300.Y5(GND) U300.Y15(GND)

### Notes on the sheet
- ZHSD ZYNQ POWER DECOUPLING
- *Zynq-7000 SoC PCB Design Guide -> Power Distribution System -> PCB Decoupling Capacitors
- THIS DOCUMENT AND THE DATA DISCLOSED HEREIN OR
- HEREWITH IS THE PROPERTY OF ALTIUM LIMITED AND MAY
- DWG NO:
- REVISION
- REV:
- DESCRIPTION
- DATE
- APPROVED
- BE FREELY DISTRIBUTED IN WHOLE. NO RIGHTS ARE
- RESERVED OR EXPRESS OR IMPLIED WARANTEE GIVEN.
- ENG:
- APPROVALS
- PROJECT
- DSN:
- CHK:
- REFERENCE DOCUMENTS
- PROJECT REVISION:
- TITLE
- DOCUMENT REVISION:
- DESIGN ITEM:
- BOM:
- FAB DWG:
- PCB DWG:
- ASSY DWG:
- SCALE:
- A3
- SIZE
- CAGE CODE
- FILE NAME
- DWG NO.
- SHEET
- OF
- REV
- (in symbol XC7Z020-2CLG400I, part H) POWER

### Library data of the parts
C300 C306-C310 C313 C318-C321 C327-C330 C333 C337-C344 C347 C353-C356 = GRM155R60J474KE19D: CAP CER 0.47UF 6.3V X5R 0402(1005) ±10%; Manufacturer: Murata Electronics; Value: 0.47 µF; ComponentLink1Description: Datasheet; ComponentLink1URL: https://search.murata.co.jp/Ceramy/image/img/A01X/G101/ENG/GRM21BR71A475KE51-01.pdf; MPN: GRM155R60J474KE19D; Package: 0402; Tolerance: ±10%; Voltage: 6.3V
C301 = GRM188R60G106ME47D: CAP CER 10UF 4V X5R 0603 (1608) ±20%; Manufacturer: Murata Electronics; Value: 10 µF; ComponentLink1Description: Datasheet; ComponentLink1URL: https://search.murata.co.jp/Ceramy/image/img/A01X/G101/ENG/GRM188R60G106ME47-01.pdf; MPN: GRM188R60G106ME47D; Package: 0603; Tolerance: ±20%; Voltage: 4V
C302 C316 C324 C334 C350 = GRM32ER70J476ME20L: CAP CER 47UF 6.3V X7R 1210 1210 (3225) ±20%; Manufacturer: Murata Electronics; Value: 47 µF; ComponentLink1Description: Datasheet; ComponentLink1URL: https://search.murata.co.jp/Ceramy/image/img/A01X/G101/ENG/GRM32ER70J476ME20-01.pdf; MPN: GRM32ER70J476ME20L; Package: 1210; Tolerance: ±20%; Voltage: 6.3V
C303 = T525D337M006ATE025: CAP TANT POLY 330UF 6.3V 2917 (7343) ±20%; Manufacturer: KEMET; ESR: 25mOhm @ 100kHz; Value: 330 µF; ComponentLink1Description: Datasheet; ComponentLink1URL: https://search.kemet.com/download/specsheet/T525D337M006ATE025; MPN: T525D337M006ATE025; Package: 2917; Tolerance: ±20%; Voltage: 6.3 V
C304 C305 C311 C314 C317 C322 C325 C326 C332 C335 C336 C345 C348 C351 C352 = CL10A475KP8NNNC: as C501 on sheet ZHSD-JTAG; ComponentLink1Description: Datasheet; ComponentLink1URL: https://mm.digikey.com/Volume0/opasdata/d220001/medias/docus/609/CL10A475KP8NNNC_Spec.pdf; MPN: CL10A475KP8NNNC; Package: 0603; Tolerance: ±10%; Voltage: 10V
C312 C315 C323 C331 C346 C349 = GRM32EE70G107ME19L: CAP CER 100UF 4V X7U 1210 (3225) ±20%; Manufacturer: Murata Electronics; Value: 100 µF; ComponentLink1Description: Datasheet; ComponentLink1URL: https://search.murata.co.jp/Ceramy/image/img/A01X/G101/ENG/GRM32EE70G107ME19-01.pdf; MPN: GRM32EE70G107ME19L; Package: 1210; Tolerance: ±20%; Voltage: 4V
C357 = CC0805KRX7RCBB102: CAP CER 1000PF 1KV X7R 0805 (2012) ±10%; Manufacturer: YAGEO; ComponentLink1Description: Datasheet; ComponentLink1URL: https://search.murata.co.jp/Ceramy/image/img/A01X/G101/ENG/GRM21BR71A475KE51-01.pdf; MPN: CC0805KRX7RCBB102; Package: 0805; Tolerance: ±10%; Value: 1000 pF
FB300 = BLM18SG121TN1D: FERRITE BEAD 120 OHM 0603 (1608) 3A 25mOhm; Manufacturer: Murata Electronics; ComponentLink1Description: Datasheet; ComponentLink1URL: https://pim.murata.com/asset/pim4/ferriteBeadInductortypefilter/ENFA0003_PDF_FERRITEBEADINDUCTORTYPEFILTER?lastModifiedDatetime=20250707190934; ComponentLink2Description: Website; ComponentLink2URL: https://pim.murata.com/en-global/pim/details/?partNum=BLM18SG121TN1%23; Current Rating (Max): 3A; DC Resistance (DCR) (Max): 25mOhm; Impedance @ Frequency: 120 Ohms @ 100 MHz; MPN: BLM18SG121TN1D; Package: 0603
R300 = CRCW06031M00FKEA: RES SMD 1M OHM 1% 1/8W 0603 (1608); Manufacturer: Vishay Dale; Value: 1 MOhms; Voltage: 75V; ComponentLink1Description: Datasheet; ComponentLink1URL: https://www.vishay.com/docs/20035/dcrcwe3.pdf; MPN: CRCW06031M00FKEA; Package: 0603
U300 = XC7Z020-2CLG400I: as U300 on sheet ZHSD-ZYNQ-CONFIG; MPN: XC7Z020-2CLG400I; ComponentLink1Description: Datasheet; ComponentLink1URL: https://docs.amd.com/v/u/en-US/ds190-Zynq-7000-Overview; ComponentLink2Description: DC and AC Switching Characteristics; ComponentLink2URL: https://docs.amd.com/v/u/en-US/ds187-XC7Z010-XC7Z020-Data-Sheet; ComponentLink3Description: PCB Design Guide; ComponentLink3URL: https://docs.amd.com/v/u/en-US/ug933-Zynq-7000-PCB; ComponentLink4Description: Packaging and Pinout; ComponentLink4URL: https://docs.amd.com/v/u/en-US/ug865-Zynq-7000-Pkg-Pinout; ComponentLink5Description: Zynq 7000 SoC Technical Reference Manual; ComponentLink5URL: https://docs.amd.com/r/en-US/ug585-zynq-7000-SoC-TRM

## Sheet ZHSD-BOOT-STORAGE.SchDoc
size 420 x 297 mm; DocumentNumber: 9; SheetNumber: 9; SheetTotal: 17; Size: A3
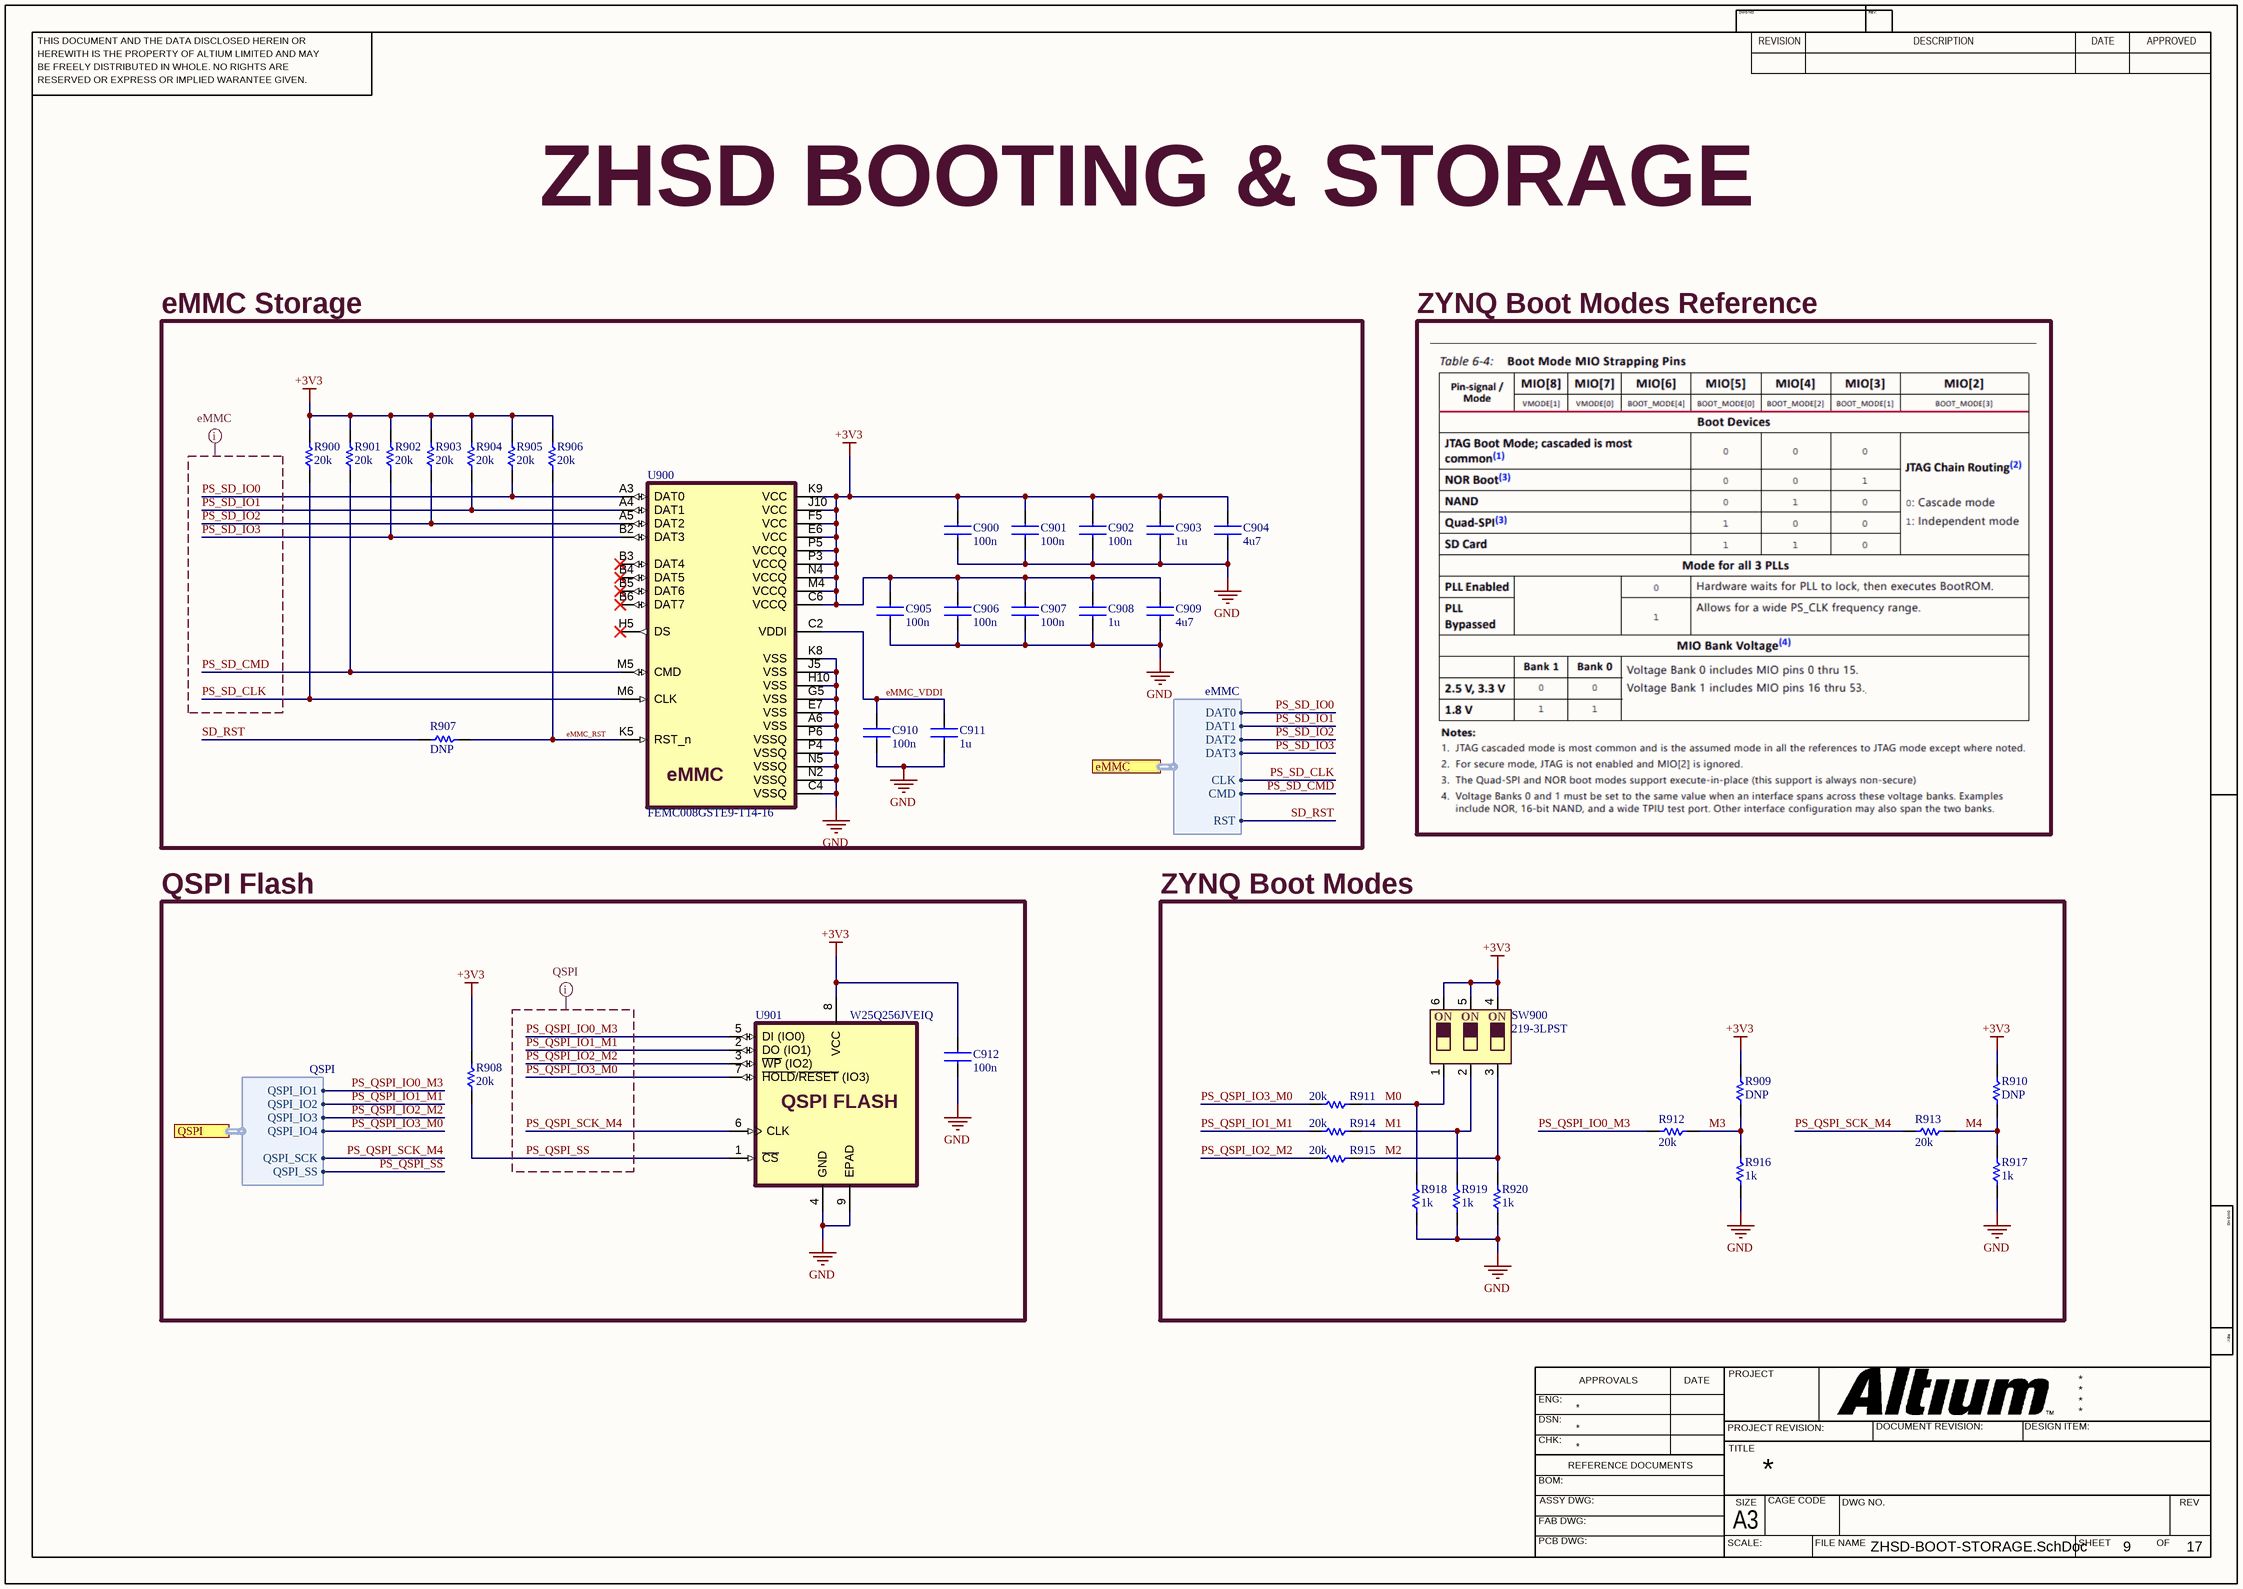
[diagram p4: ZHSD-BOOT-STORAGE.SchDoc]

### Parts
C900  100n  [0603CAPC1608X09N]
C901  100n  [0603CAPC1608X09N]
C902  100n  [0603CAPC1608X09N]
C903  1u  [0603CAPC1608X09N]
C904  4u7  [0603CAPC1608X09N]
C905  100n  [0603CAPC1608X09N]
C906  100n  [0603CAPC1608X09N]
C907  100n  [0603CAPC1608X09N]
C908  1u  [0603CAPC1608X09N]
C909  4u7  [0603CAPC1608X09N]
C910  100n  [0603CAPC1608X09N]
C911  1u  [0603CAPC1608X09N]
C912  100n  [0603CAPC1608X09N]
R900  20k  [0402RESC1005X04N]
R901  20k  [0402RESC1005X04N]
R902  20k  [0402RESC1005X04N]
R903  20k  [0402RESC1005X04N]
R904  20k  [0402RESC1005X04N]
R905  20k  [0402RESC1005X04N]
R906  20k  [0402RESC1005X04N]
R907  DNP  [0402RESC1005X04N]
R908  20k  [0402RESC1005X04N]
R909  DNP  [0402RESC1005X04N]
R910  DNP  [0402RESC1005X04N]
R911  20k  [0402RESC1005X04N]
R912  20k  [0402RESC1005X04N]
R913  20k  [0402RESC1005X04N]
R914  20k  [0402RESC1005X04N]
R915  20k  [0402RESC1005X04N]
R916  1k  [0402RESC1005X04N]
R917  1k  [0402RESC1005X04N]
R918  1k  [0402RESC1005X04N]
R919  1k  [0402RESC1005X04N]
R920  1k  [0402RESC1005X04N]
SW900  219-3LPST  [219-3LPST]
U900  FEMC008GSTE9-T14-16  [BGA153C50P14X14_1150X1300X100]
U901  W25Q256JVEIQ  [WSON8X6-SON127P800X80_HS-9N]

### Blocks framed on the sheet
eMMC Storage: C900-C911 R900-R907 U900
QSPI Flash: C912 R908 U901
ZYNQ Boot Modes: R909-R920 SW900

### Ports
eMMC (harness eMMC, see ZHSD-Block[276.36,149.98], ZHSD-ZYNQ-MIO[274.24,79.58]), QSPI (harness QSPI, see ZHSD-Block[276.36,167.76], ZHSD-ZYNQ-MIO[264.08,234.52])

### Harnesses
eMMC: DAT0, DAT1, DAT2, DAT3, CLK, CMD, RST
QSPI: QSPI_IO1, QSPI_IO2, QSPI_IO3, QSPI_IO4, QSPI_SCK, QSPI_SS

### Nets
+3V3: C900.2 C901.2 C902.2 C903.2 C904.2 C905.2 C906.2 C907.2 C908.2 C909.2 C912.2 R900.2 R901.2 R902.2 R903.2 R904.2 R905.2 R906.2 R908.2 R909.2 R910.2 SW900.4 SW900.5 SW900.6 U900.C6(VCCQ) U900.E6(VCC) U900.F5(VCC) U900.J10(VCC) U900.K9(VCC) U900.M4(VCCQ) U900.N4(VCCQ) U900.P3(VCCQ) U900.P5(VCCQ) U901.8(VCC)
GND: C900.1 C901.1 C902.1 C903.1 C904.1 C905.1 C906.1 C907.1 C908.1 C909.1 C910.1 C911.1 C912.1 R916.1 R917.1 R918.1 R919.1 R920.1 U900.A6(VSS) U900.C4(VSSQ) U900.E7(VSS) U900.G5(VSS) U900.H10(VSS) U900.J5(VSS) U900.K8(VSS) U900.N2(VSSQ) U900.N5(VSSQ) U900.P4(VSSQ) U900.P6(VSSQ) U901.4(GND) U901.9(EPAD)
eMMC_RST: R906.1 R907.2 U900.K5(RST_n)
eMMC_VDDI: C910.2 C911.2 U900.C2(VDDI)
M0: R911.1 R918.2 SW900.1
M1: R914.1 R919.2 SW900.2
M2: R915.1 R920.2 SW900.3
M3: R909.1 R912.1 R916.2
M4: R910.1 R913.1 R917.2
PS_QSPI_IO0_M3: R912.2 U901.5(DI_(IO0)) ; port QSPI.QSPI_IO1
PS_QSPI_IO1_M1: R914.2 U901.2(DO_(IO1)) ; port QSPI.QSPI_IO2
PS_QSPI_IO2_M2: R915.2 U901.3(~{WP}_(IO2)) ; port QSPI.QSPI_IO3
PS_QSPI_IO3_M0: R911.2 U901.7(~{HOLD}/~{RESET}_(IO3)) ; port QSPI.QSPI_IO4
PS_QSPI_SCK_M4: R913.2 U901.6(CLK) ; port QSPI.QSPI_SCK
PS_QSPI_SS: R908.1 U901.1(~{CS}) ; port QSPI.QSPI_SS
PS_SD_CLK: R900.1 U900.M6(CLK) ; port eMMC.CLK
PS_SD_CMD: R901.1 U900.M5(CMD) ; port eMMC.CMD
PS_SD_IO0: R905.1 U900.A3(DAT0) ; port eMMC.DAT0
PS_SD_IO1: R904.1 U900.A4(DAT1) ; port eMMC.DAT1
PS_SD_IO2: R903.1 U900.A5(DAT2) ; port eMMC.DAT2
PS_SD_IO3: R902.1 U900.B2(DAT3) ; port eMMC.DAT3
SD_RST: R907.1 ; port eMMC.RST

Not connected (* = marked no-connect by the designer): U900 B3(DAT4)* B4(DAT5)* B5(DAT6)* B6(DAT7)* H5(DS)*

### Layout directives
net class eMMC; rule Matched Net Lengths [Delay Tolerance = 50ps]: PS_SD_CLK, PS_SD_CMD, PS_SD_IO0, PS_SD_IO1, PS_SD_IO2, PS_SD_IO3
rule Matched Net Lengths [Delay Tolerance = 50ps]; net class QSPI: PS_QSPI_IO0_M3, PS_QSPI_IO1_M1, PS_QSPI_IO2_M2, PS_QSPI_IO3_M0, PS_QSPI_SCK_M4, PS_QSPI_SS

### Notes on the sheet
- ZHSD BOOTING & STORAGE
- ZYNQ Boot Modes Reference
- THIS DOCUMENT AND THE DATA DISCLOSED HEREIN OR
- HEREWITH IS THE PROPERTY OF ALTIUM LIMITED AND MAY
- DWG NO:
- REVISION
- REV:
- DESCRIPTION
- DATE
- APPROVED
- BE FREELY DISTRIBUTED IN WHOLE. NO RIGHTS ARE
- RESERVED OR EXPRESS OR IMPLIED WARANTEE GIVEN.
- ENG:
- APPROVALS
- PROJECT
- DSN:
- CHK:
- REFERENCE DOCUMENTS
- PROJECT REVISION:
- TITLE
- DOCUMENT REVISION:
- DESIGN ITEM:
- BOM:
- FAB DWG:
- PCB DWG:
- ASSY DWG:
- SCALE:
- A3
- SIZE
- CAGE CODE
- FILE NAME
- DWG NO.
- SHEET
- OF
- REV
- (in symbol 219-3LPST) ON
- (in symbol FEMC008GSTE9-T14-16) eMMC
- (in symbol W25Q256JVEIQ) QSPI FLASH

### Library data of the parts
C900-C902 C905-C907 C910 C912 = GRM155R71C104KA88J: as C500 on sheet ZHSD-JTAG; ComponentLink1Description: Datasheet; ComponentLink1URL: https://search.murata.co.jp/Ceramy/image/img/A01X/G101/ENG/GRM155R71C104KA88-01.pdf; MPN: GRM155R71C104KA88J; Package: 0402; Tolerance: ±10%; Voltage: 16V
C903 C908 C911 = GRM188R61E105KA12D: CAP CER 1UF 25V X5R 0603 (1608) ±10%; Manufacturer: Murata Power Solutions Inc.; Value: 1 µF; ComponentLink1Description: Datasheet; ComponentLink1URL: https://search.murata.co.jp/Ceramy/image/img/A01X/G101/ENG/GRM188R61E105KA12-01.pdf; MPN: GRM188R61E105KA12D; Package: 0603; Tolerance: ±10%; Voltage: 25V
C904 C909 = CL10A475KP8NNNC: as C501 on sheet ZHSD-JTAG; ComponentLink1Description: Datasheet; ComponentLink1URL: https://mm.digikey.com/Volume0/opasdata/d220001/medias/docus/609/CL10A475KP8NNNC_Spec.pdf; MPN: CL10A475KP8NNNC; Package: 0603; Tolerance: ±10%; Voltage: 10V
R900-R906 R908 R911-R915 = RC0402FR-0720KL: RES 20K OHM 1% 1/16W 0402 (1005); Manufacturer: YAGEO; Value: 20 kOhms; Voltage: 50V; ComponentLink1Description: Datasheet; ComponentLink1URL: https://yageogroup.com/content/datasheet/asset/file/PYU-RT_1-TO-0-01_ROHS_L; MPN: RC0402FR-0720KL; Tolerance: ±1%; Package: 0402
R907 R909 R910 = DNP_RES: DO NOT POPULATE RESISTOR; Manufacturer: ***; Value: ***; ComponentLink1Description: Datasheet; ComponentLink1URL: https://yageogroup.com/content/datasheet/asset/file/PYU-RT_1-TO-0-01_ROHS_L; MPN: ***; Voltage: ***; Tolerance: ***; Package: 0402
R916-R920 = RC0402JR-071KL: as R404 on sheet ZHSD-ZYNQ-CONFIG; ComponentLink1Description: Datasheet; ComponentLink1URL: https://yageogroup.com/content/datasheet/asset/file/PYU-RT_1-TO-0-01_ROHS_L; MPN: RC0402JR-071KL; Tolerance: ±5%; Package: 0402
SW900 = 219-3LPST: Dip Switch SPST 3 Position Surface Mount Slide (Standard) Actuator 100mA 20VDC; Manufacturer: CTS Electrocomponents; ComponentLink1Description: Datasheet; ComponentLink1URL: https://www.ctscorp.com/Files/DataSheets/Switches/DIP-Switches/CTS-Switches-DIP-219-Series-Datasheet.pdf; MPN: 219-3LPST
U900 = FEMC008GSTE9-T14-16: FLASH - NAND (MLC) Memory IC 64Gbit eMMC_5.1 200 MHz 153-FBGA (11.5x13); Manufacturer: Flexxon Pte Ltd; ComponentLink1Description: Datasheet; ComponentLink1URL: https://mm.digikey.com/Volume0/opasdata/d220001/medias/docus/6348/FLEXXON%20eMMC%205.1%20MLC%20%28XTRA%20III%20153ball%29%20SPEC%20V1.9.pdf; MPN: FEMC008GSTE9-T14-16; ComponentLink2Description: eMMC Design Guide; ComponentLink2URL: https://www.flexxon.com/wp-content/uploads/Technical%20Info/FLEXXON%20eMMC%20Design%20Guide%20(XTRA%20III%20153Balls)%20V1.2.pdf?x72842
U901 = W25Q256JVEIQ: FLASH - NOR Memory IC 256Mbit SPI - Quad I/O 133 MHz 8-WSON (8x6); Manufacturer: Winbond Electronics; ComponentLink1Description: Datasheet; ComponentLink1URL: https://www.winbond.com/resource-files/w25q256jv%20spi%20revg%2008032017.pdf; MPN: W25Q256JVEIQ

## Sheet ZHSD-ZYNQ-MIO.SchDoc
size 420 x 297 mm; DocumentNumber: 8; SheetNumber: 8; SheetTotal: 17; Size: A3
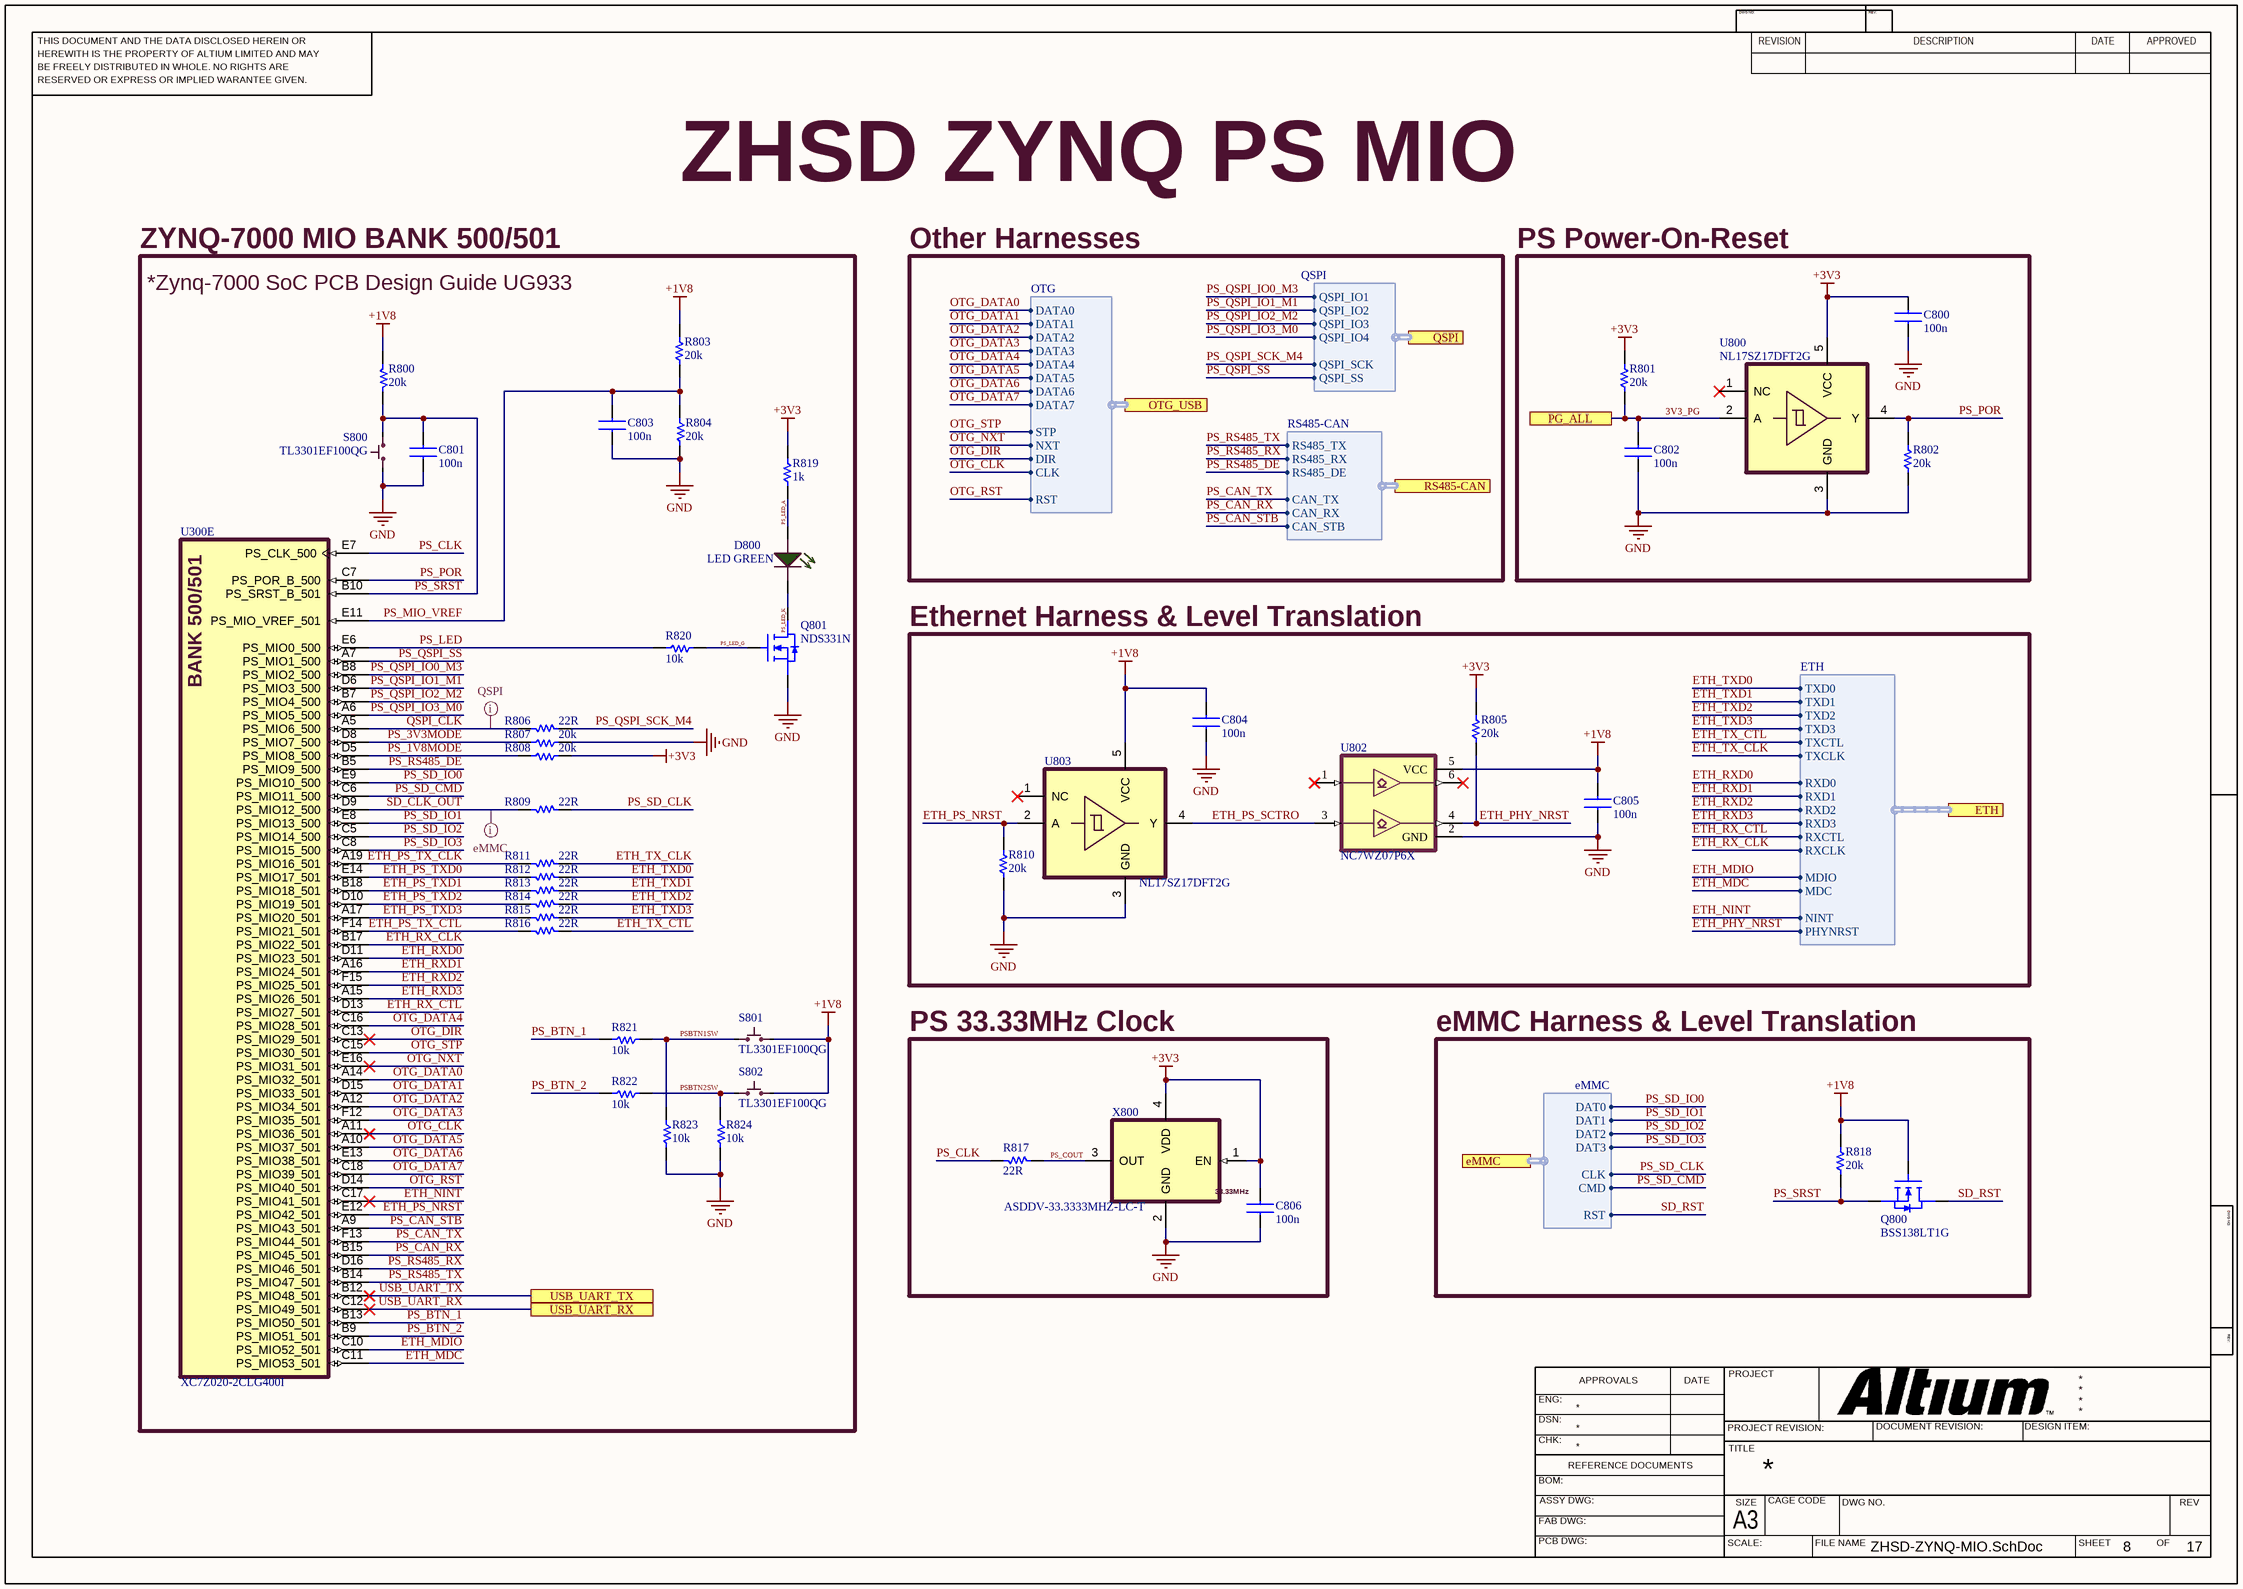
[diagram p5: ZHSD-ZYNQ-MIO.SchDoc]

### Parts
C800  100n  [0603CAPC1608X09N]
C801  100n  [0603CAPC1608X09N]
C802  100n  [0603CAPC1608X09N]
C803  100n  [0603CAPC1608X09N]
C804  100n  [0603CAPC1608X09N]
C805  100n  [0603CAPC1608X09N]
C806  100n  [0603CAPC1608X09N]
D800  LED GREEN  [0603_LED_1608N]
Q800  BSS138LT1G  [SOT95P237X89-3N]
Q801  NDS331N  [SOT95P251X112-3N]
R800  20k  [0402RESC1005X04N]
R801  20k  [0402RESC1005X04N]
R802  20k  [0402RESC1005X04N]
R803  20k  [0402RESC1005X04N]
R804  20k  [0402RESC1005X04N]
R805  20k  [0402RESC1005X04N]
R806  22R  [0603RESC1608X05N]
R807  20k  [0402RESC1005X04N]
R808  20k  [0402RESC1005X04N]
R809  22R  [0603RESC1608X05N]
R810  20k  [0402RESC1005X04N]
R811  22R  [0603RESC1608X05N]
R812  22R  [0603RESC1608X05N]
R813  22R  [0603RESC1608X05N]
R814  22R  [0603RESC1608X05N]
R815  22R  [0603RESC1608X05N]
R816  22R  [0603RESC1608X05N]
R817  22R  [0603RESC1608X05N]
R818  20k  [0402RESC1005X04N]
R819  1k  [0402RESC1005X04N]
R820  10k  [0603RESC1608X05N]
R821  10k  [0603RESC1608X05N]
R822  10k  [0603RESC1608X05N]
R823  10k  [0603RESC1608X05N]
R824  10k  [0603RESC1608X05N]
S800  TL3301EF100QG  [TL3301_Tact_SW]
S801  TL3301EF100QG  [TL3301_Tact_SW]
S802  TL3301EF100QG  [TL3301_Tact_SW]
U300  XC7Z020-2CLG400I  [BGA400C80P20X20_1700X1700X147]  (part E of 8)
U800  NL17SZ17DFT2G  [SOT65P210X110-5N]
U802  NC7WZ07P6X  [NC7WZ07]
U803  NL17SZ17DFT2G  [SOT65P210X110-5N]
X800  ASDDV-33.3333MHZ-LC-T  [XTAL_2520]

### Blocks framed on the sheet
ZYNQ-7000 MIO BANK 500/501: C801 C803 D800 Q801 R800 R803 R804 R806-R809 R811-R816 R819-R824 S800-S802 U300
PS Power-On-Reset: C800 C802 R801 R802 U800
Ethernet Harness & Level Translation: C804 C805 R805 R810 U802 U803
PS 33.33MHz Clock: C806 R817 X800
eMMC Harness & Level Translation: Q800 R818

### Ports
eMMC (harness eMMC, see ZHSD-Block[253.5,149.98], ZHSD-BOOT-STORAGE[195.58,144.78]), ETH (harness ETH, see ZHSD-Block[174.76,116.96], ZHSD-ETHERNET[43.18,203.2]), OTG_USB (harness OTG, see ZHSD-Block[174.76,149.98], ZHSD-USB-OTG[27.903,180.34]), PG_ALL (see ZHSD-Block[174.76,177.92], ZHSD-POWER[28.56,47.02]), QSPI (harness QSPI, see ZHSD-Block[253.5,167.76], ZHSD-BOOT-STORAGE[22.86,76.2]), RS485-CAN (harness RS485-CAN, see ZHSD-Block[174.76,132.2], ZHSD-RS485-CAN[256.54,58.42]), USB_UART_RX (see ZHSD-Block[174.76,167.76], ZHSD-USB-UART[251.46,99.06]), USB_UART_TX (see ZHSD-Block[174.76,172.84], ZHSD-USB-UART[251.46,55.88])

### Harnesses
QSPI: QSPI_IO1, QSPI_IO2, QSPI_IO3, QSPI_IO4, QSPI_SCK, QSPI_SS
eMMC: DAT0, DAT1, DAT2, DAT3, CLK, CMD, RST
OTG: DATA0, DATA1, DATA2, DATA3, DATA4, DATA5, DATA6, DATA7, STP, NXT, DIR, CLK, RST
ETH: TXCLK, TXD0, TXD1, TXD2, TXD3, TXCTL, RXCLK, RXD0, RXD1, RXD2, RXD3, RXCTL, MDIO, MDC, NINT, PHYNRST
RS485-CAN: RS485_TX, RS485_RX, RS485_DE, CAN_TX, CAN_RX, CAN_STB

### Nets
+1V8: C804.2 C805.2 Q800.1(G) R800.2 R803.2 R818.2 S801.3,4 S802.3,4 U802.5(VCC) U803.5(VCC)
+3V3: C800.2 C806.2 R801.2 R805.2 R808.1 R819.2 U800.5(VCC) X800.1(EN) X800.4(VDD)
GND: C800.1 C801.1 C802.1 C803.2 C804.1 C805.1 C806.1 Q801.2(S) R802.1 R804.2 R807.1 R810.1 R823.2 R824.2 S800.1,2 U800.3(GND) U802.2(GND) U803.3(GND) X800.2(GND)
3V3_PG: C802.2 R801.1 U800.2(A) ; port PG_ALL
ETH_MDC: U300.C11(PS_MIO53_501) ; port ETH.MDC
ETH_MDIO: U300.C10(PS_MIO52_501) ; port ETH.MDIO
ETH_NINT: U300.C17(PS_MIO41_501) ; port ETH.NINT
ETH_PHY_NRST: R805.1 U802.4(Y2) ; port ETH.PHYNRST
ETH_PS_NRST: R810.2 U300.E12(PS_MIO42_501) U803.2(A)
ETH_PS_SCTRO: U802.3(A2) U803.4(Y)
ETH_PS_TX_CLK: R811.2 U300.A19(PS_MIO16_501)
ETH_PS_TX_CTL: R816.2 U300.F14(PS_MIO21_501)
ETH_PS_TXD0: R812.2 U300.E14(PS_MIO17_501)
ETH_PS_TXD1: R813.2 U300.B18(PS_MIO18_501)
ETH_PS_TXD2: R814.2 U300.D10(PS_MIO19_501)
ETH_PS_TXD3: R815.2 U300.A17(PS_MIO20_501)
ETH_RX_CLK: U300.B17(PS_MIO22_501) ; port ETH.RXCLK
ETH_RX_CTL: U300.D13(PS_MIO27_501) ; port ETH.RXCTL
ETH_RXD0: U300.D11(PS_MIO23_501) ; port ETH.RXD0
ETH_RXD1: U300.A16(PS_MIO24_501) ; port ETH.RXD1
ETH_RXD2: U300.F15(PS_MIO25_501) ; port ETH.RXD2
ETH_RXD3: U300.A15(PS_MIO26_501) ; port ETH.RXD3
ETH_TX_CLK: R811.1 ; port ETH.TXCLK
ETH_TX_CTL: R816.1 ; port ETH.TXCTL
ETH_TXD0: R812.1 ; port ETH.TXD0
ETH_TXD1: R813.1 ; port ETH.TXD1
ETH_TXD2: R814.1 ; port ETH.TXD2
ETH_TXD3: R815.1 ; port ETH.TXD3
OTG_CLK: U300.A11(PS_MIO36_501) ; port OTG_USB.CLK
OTG_DATA0: U300.A14(PS_MIO32_501) ; port OTG_USB.DATA0
OTG_DATA1: U300.D15(PS_MIO33_501) ; port OTG_USB.DATA1
OTG_DATA2: U300.A12(PS_MIO34_501) ; port OTG_USB.DATA2
OTG_DATA3: U300.F12(PS_MIO35_501) ; port OTG_USB.DATA3
OTG_DATA4: U300.C16(PS_MIO28_501) ; port OTG_USB.DATA4
OTG_DATA5: U300.A10(PS_MIO37_501) ; port OTG_USB.DATA5
OTG_DATA6: U300.E13(PS_MIO38_501) ; port OTG_USB.DATA6
OTG_DATA7: U300.C18(PS_MIO39_501) ; port OTG_USB.DATA7
OTG_DIR: U300.C13(PS_MIO29_501) ; port OTG_USB.DIR
OTG_NXT: U300.E16(PS_MIO31_501) ; port OTG_USB.NXT
OTG_RST: U300.D14(PS_MIO40_501) ; port OTG_USB.RST
OTG_STP: U300.C15(PS_MIO30_501) ; port OTG_USB.STP
PS_1V8MODE: R808.2 U300.D5(PS_MIO8_500)
PS_3V3MODE: R807.2 U300.D8(PS_MIO7_500)
PS_BTN_1: R821.2 U300.B13(PS_MIO50_501)
PS_BTN_2: R822.2 U300.B9(PS_MIO51_501)
PS_CAN_RX: U300.B15(PS_MIO45_501) ; port RS485-CAN.CAN_RX  [project net RSCAN.CAN_RX]
PS_CAN_STB: U300.A9(PS_MIO43_501) ; port RS485-CAN.CAN_STB  [project net RSCAN.CAN_STB]
PS_CAN_TX: U300.F13(PS_MIO44_501) ; port RS485-CAN.CAN_TX  [project net RSCAN.CAN_TX]
PS_CLK: R817.2 U300.E7(PS_CLK_500)
PS_COUT: R817.1 X800.3(OUT)
PS_LED: R820.2 U300.E6(PS_MIO0_500)
PS_LED_A: D800.1(A) R819.1
PS_LED_G: Q801.1(G) R820.1
PS_LED_K: D800.2(C) Q801.3(D)
PS_MIO_VREF: C803.1 R803.1 R804.1 U300.E11(PS_MIO_VREF_501)
PS_POR: R802.2 U300.C7(PS_POR_B_500) U800.4(Y)
PS_QSPI_IO0_M3: U300.B8(PS_MIO2_500) ; port QSPI.QSPI_IO1
PS_QSPI_IO1_M1: U300.D6(PS_MIO3_500) ; port QSPI.QSPI_IO2
PS_QSPI_IO2_M2: U300.B7(PS_MIO4_500) ; port QSPI.QSPI_IO3
PS_QSPI_IO3_M0: U300.A6(PS_MIO5_500) ; port QSPI.QSPI_IO4
PS_QSPI_SCK_M4: R806.1 ; port QSPI.QSPI_SCK
PS_QSPI_SS: U300.A7(PS_MIO1_500) ; port QSPI.QSPI_SS
PS_RS485_DE: U300.B5(PS_MIO9_500) ; port RS485-CAN.RS485_DE  [project net RSCAN.RS485_DE]
PS_RS485_RX: U300.D16(PS_MIO46_501) ; port RS485-CAN.RS485_RX  [project net RSCAN.RS485_RX]
PS_RS485_TX: U300.B14(PS_MIO47_501) ; port RS485-CAN.RS485_TX  [project net RSCAN.RS485_TX]
PS_SD_CLK: R809.1 ; port eMMC.CLK
PS_SD_CMD: U300.C6(PS_MIO11_500) ; port eMMC.CMD
PS_SD_IO0: U300.E9(PS_MIO10_500) ; port eMMC.DAT0
PS_SD_IO1: U300.E8(PS_MIO13_500) ; port eMMC.DAT1
PS_SD_IO2: U300.C5(PS_MIO14_500) ; port eMMC.DAT2
PS_SD_IO3: U300.C8(PS_MIO15_500) ; port eMMC.DAT3
PS_SRST: C801.2 Q800.2(S) R800.1 R818.1 S800.3,4 U300.B10(PS_SRST_B_501)
PSBTN1SW: R821.1 R823.1 S801.1,2
PSBTN2SW: R822.1 R824.1 S802.1,2
QSPI_CLK: R806.2 U300.A5(PS_MIO6_500)
SD_CLK_OUT: R809.2 U300.D9(PS_MIO12_500)
SD_RST: Q800.3(D) ; port eMMC.RST
USB_UART_RX: U300.C12(PS_MIO49_501) ; port USB_UART_RX
USB_UART_TX: U300.B12(PS_MIO48_501) ; port USB_UART_TX

Not connected (* = marked no-connect by the designer): U800 1(NC)*; U802 1(A1)* 6(Y1)*; U803 1(NC)*

### Layout directives
net class eMMC; rule Matched Net Lengths [Delay Tolerance = 50ps]: SD_CLK_OUT
rule Matched Net Lengths [Delay Tolerance = 50ps]; net class QSPI: QSPI_CLK

### Notes on the sheet
- ZHSD ZYNQ PS MIO
- Other Harnesses
- *Zynq-7000 SoC PCB Design Guide UG933
- THIS DOCUMENT AND THE DATA DISCLOSED HEREIN OR
- HEREWITH IS THE PROPERTY OF ALTIUM LIMITED AND MAY
- DWG NO:
- REVISION
- REV:
- DESCRIPTION
- DATE
- APPROVED
- BE FREELY DISTRIBUTED IN WHOLE. NO RIGHTS ARE
- RESERVED OR EXPRESS OR IMPLIED WARANTEE GIVEN.
- ENG:
- APPROVALS
- PROJECT
- DSN:
- CHK:
- REFERENCE DOCUMENTS
- PROJECT REVISION:
- TITLE
- DOCUMENT REVISION:
- DESIGN ITEM:
- BOM:
- FAB DWG:
- PCB DWG:
- ASSY DWG:
- SCALE:
- A3
- SIZE
- CAGE CODE
- FILE NAME
- DWG NO.
- SHEET
- OF
- REV
- (in symbol ASDDV-33.3333MHZ-LC-T) 33.33MHz
- (in symbol XC7Z020-2CLG400I, part E) BANK 500/501

### Library data of the parts
C800-C806 = GRM155R71C104KA88J: as C500 on sheet ZHSD-JTAG; ComponentLink1Description: Datasheet; ComponentLink1URL: https://search.murata.co.jp/Ceramy/image/img/A01X/G101/ENG/GRM155R71C104KA88-01.pdf; MPN: GRM155R71C104KA88J; Package: 0402; Tolerance: ±10%; Voltage: 16V
D800 = LTST-C191TGKT: as D400 on sheet ZHSD-ZYNQ-CONFIG; ComponentLink1Description: Datasheet; ComponentLink1URL: https://optoelectronics.liteon.com/upload/download/DS22-2000-300/LTST-C191TGKT.PDF; MPN: LTST-C191TGKT; Package: 0603
Q800 = BSS138LT1G: N-Channel 50 V 200mA (Ta) 225mW (Ta) Surface Mount SOT-23-3 (TO-236); Manufacturer: onsemi; Drain to Source Voltage (Vdss): 50 V; Rds On (Max) @ Id, Vgs: 3.5Ohm @ 200mA, 5V; Vgs (Max): ±20V; ComponentLink1Description: Datasheet; ComponentLink1URL: https://www.onsemi.com/pdf/datasheet/bss138lt1-d.pdf; MPN: BSS138LT1G; Package: SOT-23-3
Q801 = NDS331N: as Q400 on sheet ZHSD-ZYNQ-CONFIG; ComponentLink1Description: Datasheet; ComponentLink1URL: https://www.onsemi.com/pdf/datasheet/nds331n-d.pdf; MPN: NDS331N; Package: SOT-23-3
R800-R805 R807 R808 R810 R818 = RC0402FR-0720KL: as R900 on sheet ZHSD-BOOT-STORAGE; ComponentLink1Description: Datasheet; ComponentLink1URL: https://yageogroup.com/content/datasheet/asset/file/PYU-RT_1-TO-0-01_ROHS_L; MPN: RC0402FR-0720KL; Tolerance: ±1%; Package: 0402
R806 R809 R811-R817 = RC0603FR-0722RL: as R500 on sheet ZHSD-JTAG; ComponentLink1Description: Datasheet; ComponentLink1URL: https://yageogroup.com/content/datasheet/asset/file/PYU-RC_GROUP_51_ROHS_L; MPN: RC0603FR-0722RL; Tolerance: ±1%; Package: 0603
R819 = RC0402JR-071KL: as R404 on sheet ZHSD-ZYNQ-CONFIG; ComponentLink1Description: Datasheet; ComponentLink1URL: https://yageogroup.com/content/datasheet/asset/file/PYU-RT_1-TO-0-01_ROHS_L; MPN: RC0402JR-071KL; Tolerance: ±5%; Package: 0402
R820-R824 = RC0603FR-0710KL: as R400 on sheet ZHSD-ZYNQ-CONFIG; ComponentLink1Description: Datasheet; ComponentLink1URL: https://yageogroup.com/content/datasheet/asset/file/PYU-RC_GROUP_51_ROHS_L; MPN: RC0603FR-0710KL; Tolerance: ±1%; Package: 0603
S800-S802 = TL3301EF100QG: SWITCH TACTILE SPST-NO 0.05A 12V; pin to pad: 1,2>1+2 3,4>3+4; Manufacturer: E-Switch; ComponentLink1Description: Datasheet; ComponentLink1URL: https://configured-product-images.s3.amazonaws.com/Datasheets/TL3301.pdf; MPN: TL3301EF100QG
U300 = XC7Z020-2CLG400I: as U300 on sheet ZHSD-ZYNQ-CONFIG; MPN: XC7Z020-2CLG400I; ComponentLink1Description: Datasheet; ComponentLink1URL: https://docs.amd.com/v/u/en-US/ds190-Zynq-7000-Overview; ComponentLink2Description: DC and AC Switching Characteristics; ComponentLink2URL: https://docs.amd.com/v/u/en-US/ds187-XC7Z010-XC7Z020-Data-Sheet; ComponentLink3Description: PCB Design Guide; ComponentLink3URL: https://docs.amd.com/v/u/en-US/ug933-Zynq-7000-PCB; ComponentLink4Description: Packaging and Pinout; ComponentLink4URL: https://docs.amd.com/v/u/en-US/ug865-Zynq-7000-Pkg-Pinout; ComponentLink5Description: Zynq 7000 SoC Technical Reference Manual; ComponentLink5URL: https://docs.amd.com/r/en-US/ug585-zynq-7000-SoC-TRM
U800 U803 = NL17SZ17DFT2G: IC BUFFER NON-INVERT 5.5V SC-88A; Manufacturer: onsemi; ComponentLink1Description: Datasheet; ComponentLink1URL: https://www.onsemi.com/pdf/datasheet/nl17sz17-d.pdf; MPN: NL17SZ17DFT2G
U802 = NC7WZ07P6X: IC BUFFER NON-INVERT 5.5V SC-88; Manufacturer: onsemi; ComponentLink1Description: Datasheet; ComponentLink1URL: https://www.onsemi.com/pdf/datasheet/nc7wz07-d.pdf; MPN: NC7WZ07P6X
X800 = ASDDV-33.3333MHZ-LC-T: 33.3333 MHz XO (Standard) HCMOS, LVCMOS Oscillator 1.6V ~ 3.6V Enable/Disable 4-SMD, No Lead; Manufacturer: Abracon LLC; ComponentLink1Description: Datasheet; ComponentLink1URL: https://abracon.com/datasheets/ASDDV.pdf; MPN: ASDDV-33.3333MHZ-LC-T